# EAGLE design flight_logger_r2 (EAGLE 5.11)
PARTNUM: ABMM-12.000MHZ-B2-T

## Sheet 1 of 3
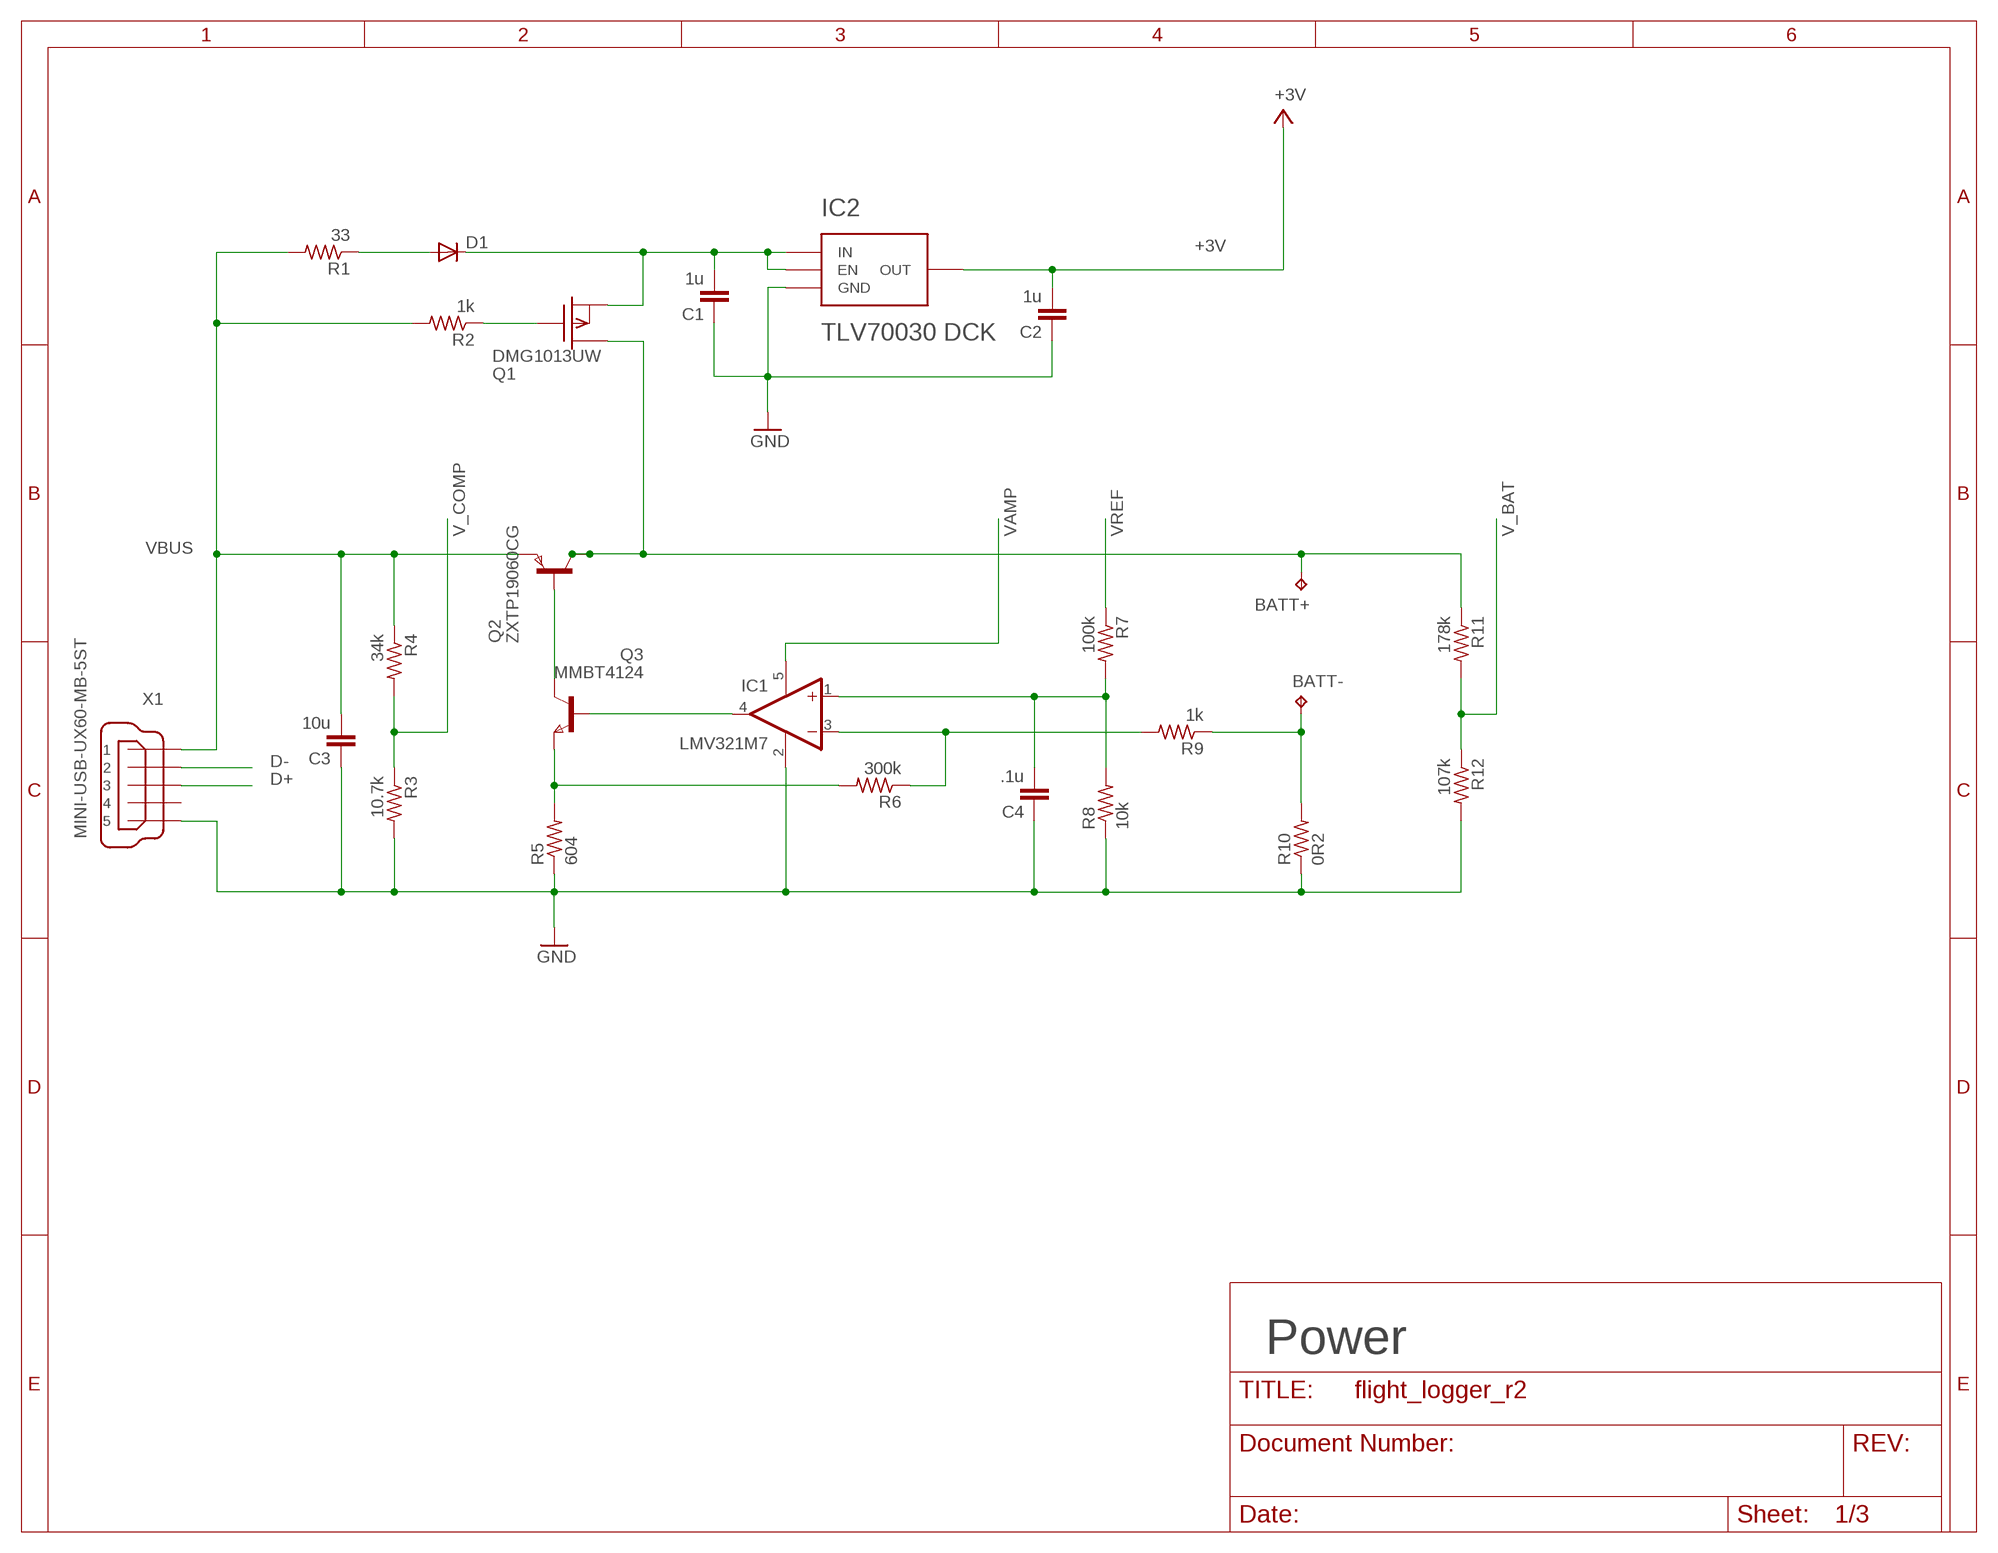
[diagram p0: schematic, sheet 1]

### Parts
BATT+  TPTP18R  [TP18R]
BATT-  TPTP18R  [TP18R]
C1  1u  C-EUC0603  [C0603]
C2  1u  C-EUC0603  [C0603]
C3  10u  C-EUC0805  [C0805]
C4  .1u  C-EUC0603  [C0603]
D1  DIODE-MINIMELF  [MINIMELF]
IC1  LMV321M7  [SC70-5L]
IC2  TLV70030 DCK  TLV700XX_DCK  [SC70-5_DCK]
Q1  DMG1013UW  [SOT323]
Q2  ZXTP19060CG  PNPSOT223  [SOT223]
Q3  MMBT4124  NPNSOT23  [SOT-23]
R1  33  R-US_R0603  [R0603]
R2  1k  R-US_R0603  [R0603]
R3  10.7k  R-US_R0603  [R0603]
R4  34k  R-US_R0603  [R0603]
R5  604  R-US_R0603  [R0603]
R6  300k  R-US_R0603  [R0603]
R7  100k  R-US_R0603  [R0603]
R8  10k  R-US_R0603  [R0603]
R9  1k  R-US_R0603  [R0603]
R10  0R2  R-US_R1206  [R1206]
R11  178k  R-US_R0603  [R0603]
R12  107k  R-US_R0603  [R0603]
X1  MINI-USB-UX60-MB-5ST  [UX60-MB-5ST]

### Nets
+3V: C2.2 IC2.5(OUT) ; also sheet 2,3
D+: X1.3 ; also sheet 3
D-: X1.2 ; also sheet 3
GND: C1.1 C2.1 C3.1 C4.1 IC1.2(V-) IC2.2(GND) R3.2 R5.1 R8.1 R10.1 R12.2 X1.5 ; also sheet 2,3
N$1: Q2.1(B) Q3.1(C)
N$2: Q3.2(E) R5.2 R6.2
N$7: D1.A R1.1
N$8: IC1.4(OUT) Q3.3(B)
N$9: IC1.3(-IN) R6.1 R9.2
N$10: Q1.1(G) R2.1
N$12: C1.2 D1.C IC2.1(IN) IC2.3(EN) Q1.2(S)
N$18: BATT-.TP R9.1 R10.2
N$33: C4.2 IC1.1(+IN) R7.2 R8.2
V_BAT: R11.2 R12.1 ; also sheet 2
V_COMP: R3.1 R4.2 ; also sheet 2
VAMP: IC1.5(V+) ; also sheet 2
VBAT: BATT+.TP Q1.3(D) Q2.2(C) Q2.4(C1) R11.1
VBUS: C3.2 Q2.3(E) R1.2 R2.2 R4.1 X1.1 ; also sheet 3
VREF: R7.1 ; also sheet 2
Unconnected: X1.4

### Notes on the sheet
- Power

## Sheet 2 of 3
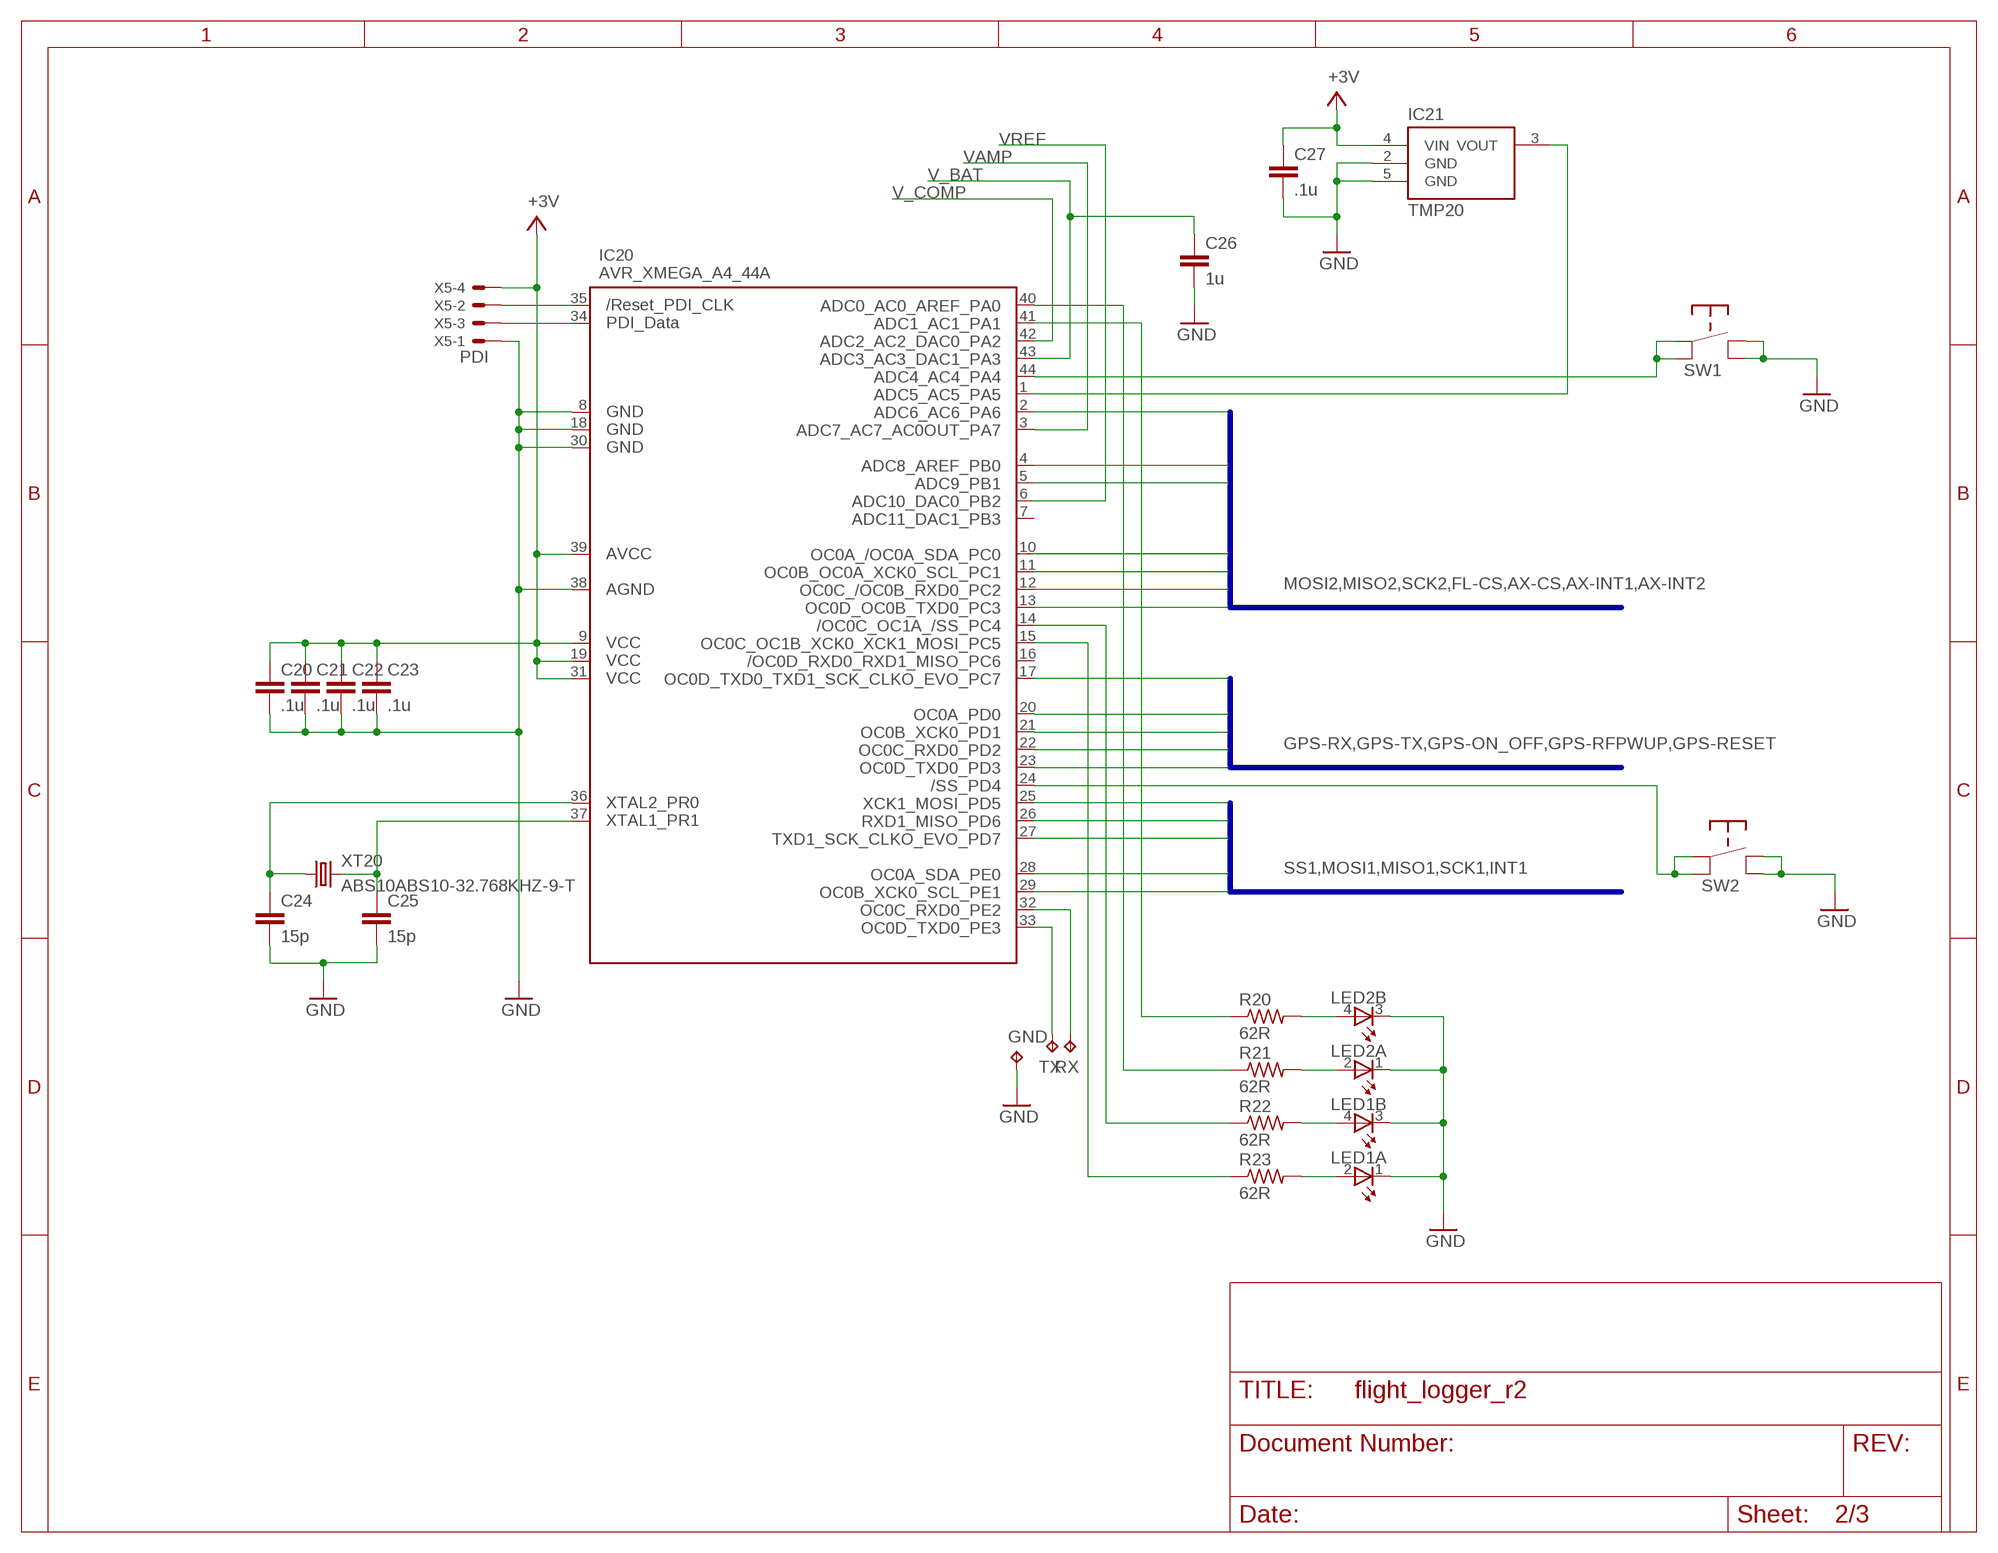
[diagram p1: schematic, sheet 2]

### Parts
C20  .1u  C-EUC0603  [C0603]
C21  .1u  C-EUC0603  [C0603]
C22  .1u  C-EUC0603  [C0603]
C23  .1u  C-EUC0603  [C0603]
C24  15p  C-EUC0603  [C0603]
C25  15p  C-EUC0603  [C0603]
C26  1u  C-EUC0603  [C0603]
C27  .1u  C-EUC0603  [C0603]
GND  TPTP14R  [TP14R]
IC20  AVR_XMEGA_A4_44A  [TQFP44]
IC21  TMP20  TMP20_DCK  [SC70-5_DCK]
LED1  TOPLED-2-LSG_T676_SMALLPAD  [P-LCC-4_SMALLPAD]
LED2  TOPLED-2-LSG_T676_SMALLPAD  [P-LCC-4_SMALLPAD]
R20  62R  R-US_R0603  [R0603]
R21  62R  R-US_R0603  [R0603]
R22  62R  R-US_R0603  [R0603]
R23  62R  R-US_R0603  [R0603]
RX  TPTP14R  [TP14R]
SW1  Power  PANASONIC-EVQP2  [PANASONIC_EVQP2_TACT-SWITCH]
SW2  Mark  PANASONIC-EVQP2  [PANASONIC_EVQP2_TACT-SWITCH]
TX  TPTP14R  [TP14R]
X5  PDI  53047-04  [53047-04]
XT20  ABS10ABS10-32.768KHZ-9-T  ABS10-32.768KHZ-9-T  [ABS10_SMD_CRYSTAL]

### Nets
+3V: C20.1 C21.1 C22.1 C23.1 C27.1 IC20.9(VCC1) IC20.19(VCC2) IC20.31(VCC3) IC20.39(AVCC) IC21.4(VIN) X5.4 ; also sheet 1,3
AX-CS: IC20.4(PB0) ; also sheet 3
AX-INT1: IC20.2(PA6) ; also sheet 3
AX-INT2: IC20.5(PB1) ; also sheet 3
DEBUG-RX: IC20.32(PE2) RX.TP
DEBUG-TX: IC20.33(PE3) TX.TP
FL-CS: IC20.10(PC0) ; also sheet 3
GND: C20.2 C21.2 C22.2 C23.2 C24.2 C25.2 C26.2 C27.2 GND.TP IC20.8(GND1) IC20.18(GND2) IC20.30(GND3) IC20.38(AGND) IC21.2(GND) IC21.5(GND) LED1.1(A:C) LED1.3(B:C) LED2.1(A:C) LED2.3(B:C) SW1.1(NO) SW1.3(NO) SW2.1(NO) SW2.3(NO) X5.1 ; also sheet 1,3
GPS-ON_OFF: IC20.21(PD1) ; also sheet 3
GPS-RESET: IC20.20(PD0) ; also sheet 3
GPS-RFPWUP: IC20.17(PC7) ; also sheet 3
GPS-RX: IC20.23(PD3) ; also sheet 3
GPS-TX: IC20.22(PD2) ; also sheet 3
INT1: IC20.28(PE0) ; also sheet 3
MISO1: IC20.26(PD6) ; also sheet 3
MISO2: IC20.12(PC2) ; also sheet 3
MOSI1: IC20.27(PD7) ; also sheet 3
MOSI2: IC20.13(PC3) ; also sheet 3
N$4: IC20.1(PA5) IC21.3(VOUT)
N$14: C24.1 IC20.36(PR0) XT20.P$1
N$15: C25.1 IC20.37(PR1) XT20.P$2
N$21: IC20.15(PC5) R23.1
N$22: LED2.4(B:A) R20.2
N$23: LED2.2(A:A) R21.2
N$24: IC20.14(PC4) R22.1
N$25: IC20.40(PA0) R21.1
N$26: LED1.4(B:A) R22.2
N$27: LED1.2(A:A) R23.2
N$28: IC20.35(RESET) X5.2
N$29: IC20.34(PDI_DATA) X5.3
N$30: IC20.44(PA4) SW1.2(COMMON) SW1.4(COMMON)
N$31: IC20.41(PA1) R20.1
N$32: IC20.24(PD4) SW2.2(COMMON) SW2.4(COMMON)
SCK1: IC20.25(PD5) ; also sheet 3
SCK2: IC20.11(PC1) ; also sheet 3
SS1: IC20.29(PE1) ; also sheet 3
V_BAT: C26.1 IC20.43(PA3) ; also sheet 1
V_COMP: IC20.42(PA2) ; also sheet 1
VAMP: IC20.3(PA7) ; also sheet 1
VREF: IC20.6(PB2) ; also sheet 1
Unconnected: IC20.7(PB3) IC20.16(PC6)

### Buses
SS1,MOSI1,MISO1,SCK1,INT1
GPS-RX,GPS-TX,GPS-ON_OFF,GPS-RFPWUP,GPS-RESET
MOSI2,MISO2,SCK2,FL-CS,AX-CS,AX-INT1,AX-INT2

## Sheet 3 of 3
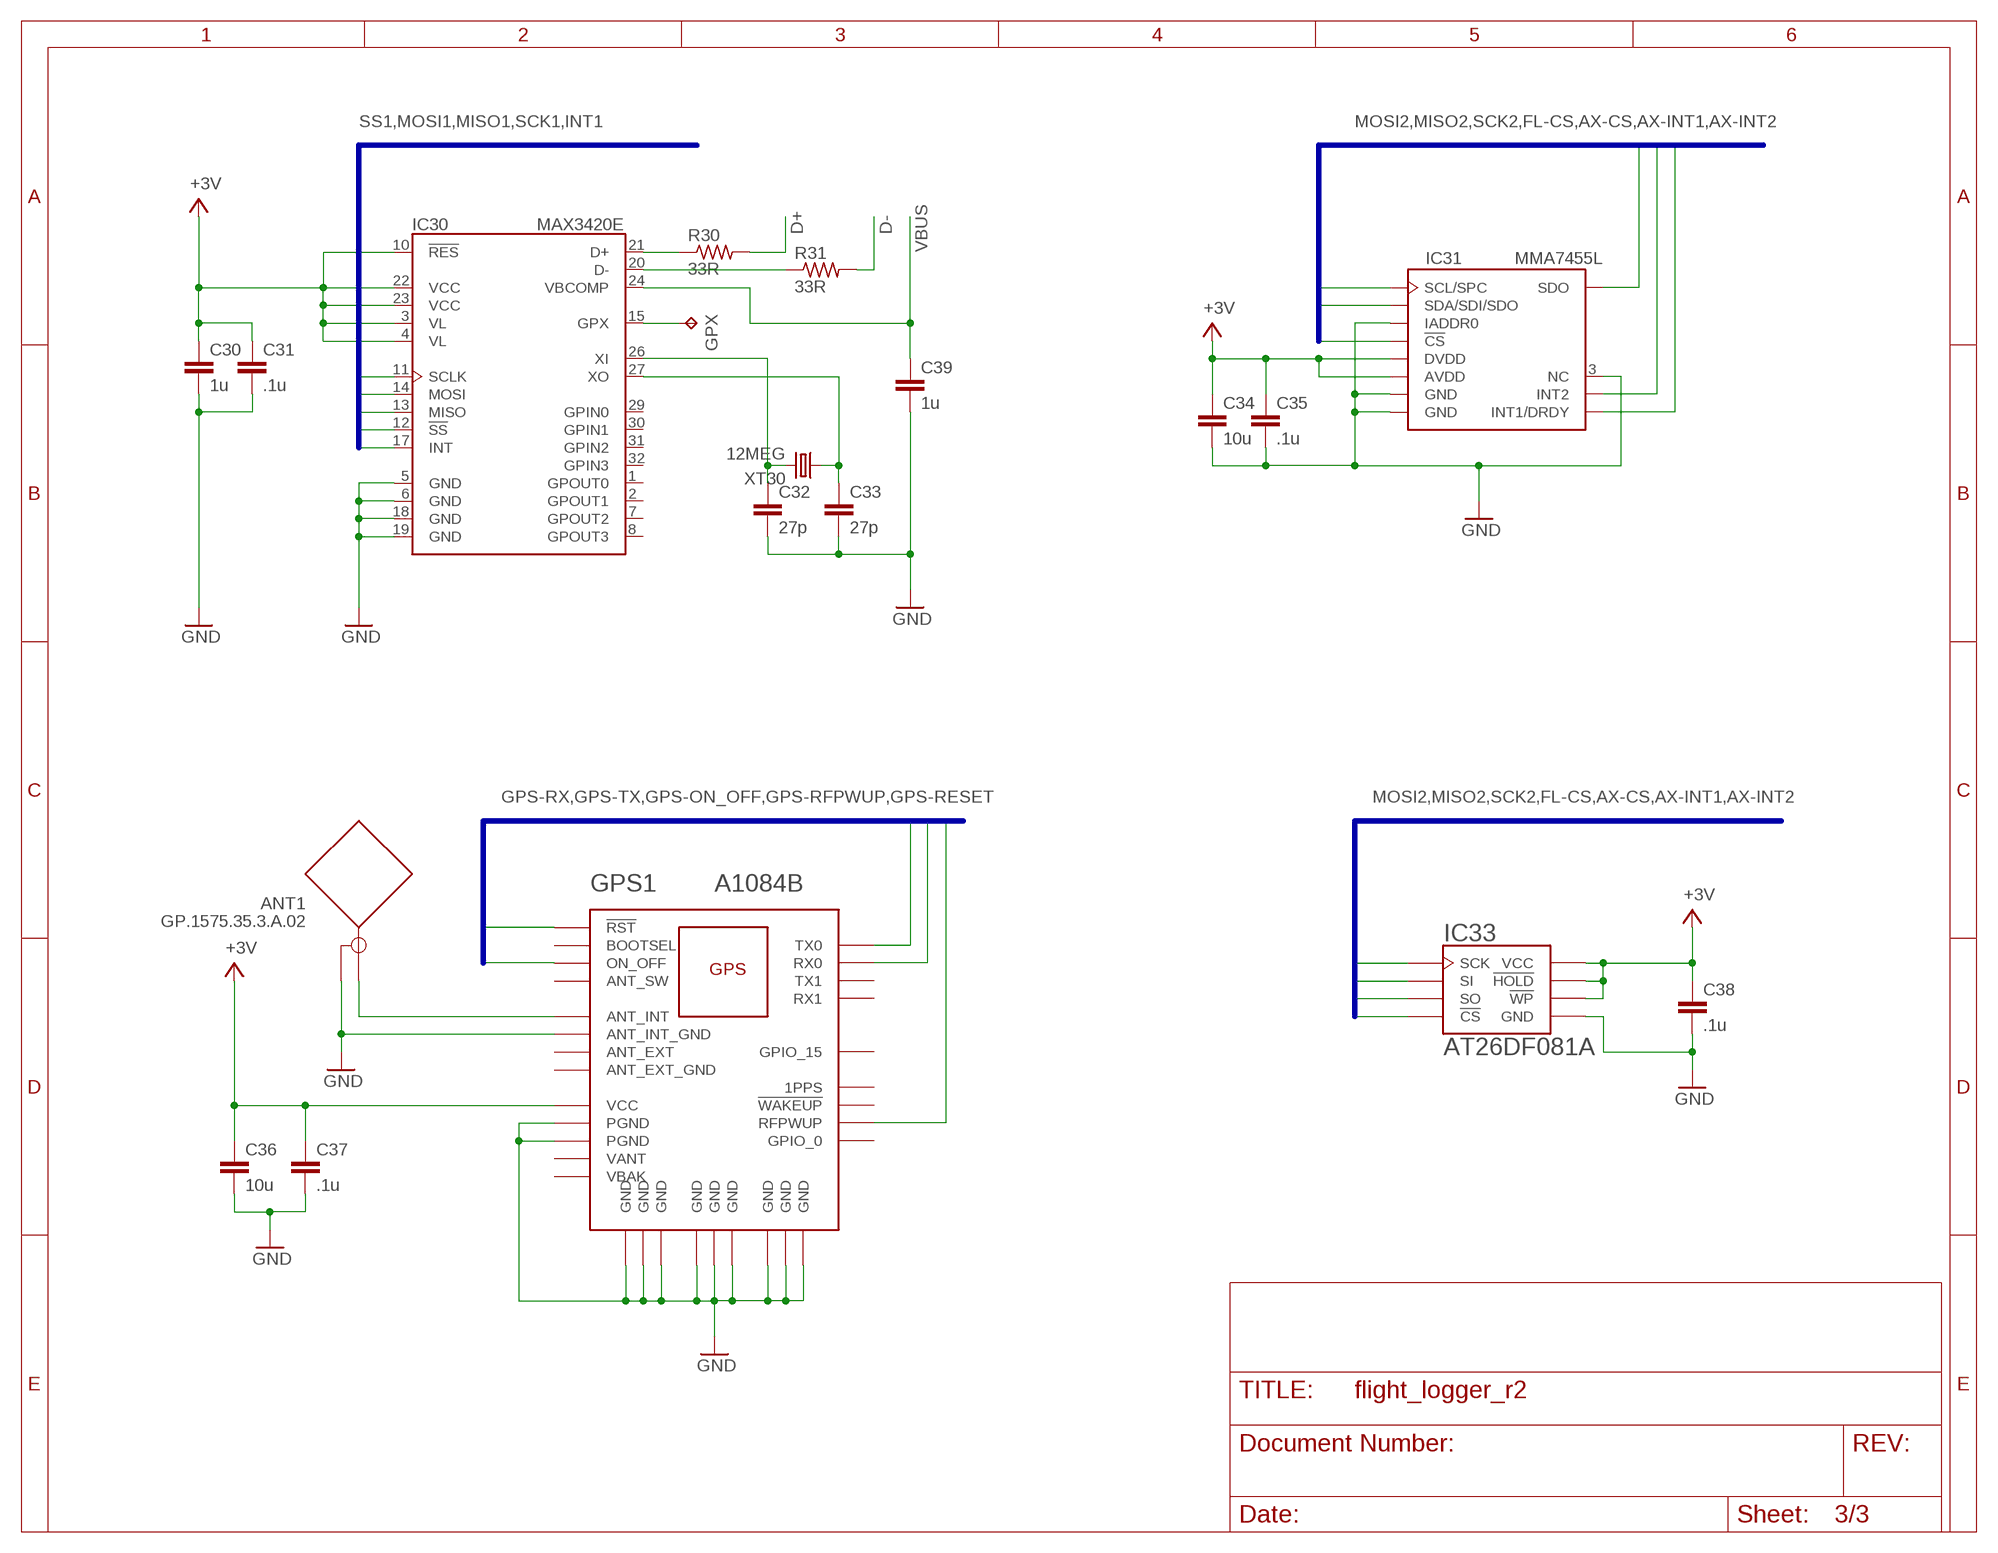
[diagram p2: schematic, sheet 3]

### Parts
ANT1  GP.1575.35.3.A.02  TAOGLAS_GP-1575.35  [TAOGLAS_GP35-A_GPS_PATCH_ANTENNA]
C30  1u  C-EUC0603  [C0603]
C31  .1u  C-EUC0603  [C0603]
C32  27p  C-EUC0603  [C0603]
C33  27p  C-EUC0603  [C0603]
C34  10u  C-EUC0603  [C0603]
C35  .1u  C-EUC0603  [C0603]
C36  10u  C-EUC0805  [C0805]
C37  .1u  C-EUC0603  [C0603]
C38  .1u  C-EUC0603  [C0603]
C39  1u  C-EUC0603  [C0603]
GPS1  A1084B  VINCOTECH-GPS_A1084  [A1084_GPS]
GPX  TPTP10R  [TP10R]
IC30  MAX3420E  MAX3420EECJ  [LQFP-32]
IC31  MMA7455L  MMA7455LLARGEPAD  [LGA-14-LARGEPAD]
IC33  AT26DF081A  AT26DF081A-SU  [EIAJ-SOIC8]
R30  33R  R-US_R0603  [R0603]
R31  33R  R-US_R0603  [R0603]
XT30  12MEG  ABMM-XTAL  [XTAL-5.2X7.2]

### Nets
+3V: C30.1 C31.1 C34.1 C35.1 C36.1 C37.1 C38.1 GPS1.P$3(VCC) IC30.3(VL) IC30.4(VL) IC30.10(!RES) IC30.22(VCC) IC30.23(VCC) IC31.1(DVDD) IC31.6(AVDD) IC33.3(!WP) IC33.7(!HOLD) IC33.8(VCC) ; also sheet 1,2
AX-CS: IC31.7(!CS) ; also sheet 2
AX-INT1: IC31.8(INT1/DRDY) ; also sheet 2
AX-INT2: IC31.9(INT2) ; also sheet 2
D+: R30.2 ; also sheet 1
D-: R31.2 ; also sheet 1
FL-CS: IC33.1(!CS) ; also sheet 2
GND: ANT1.GND C30.2 C31.2 C32.2 C33.2 C34.2 C35.2 C36.2 C37.2 C38.2 C39.2 GPS1.GND@1(GND) GPS1.GND@2(GND) GPS1.GND@3(GND) GPS1.GND@4(GND) GPS1.GND@5(GND) GPS1.GND@6(GND) GPS1.GND@7(GND) GPS1.GND@8(GND) GPS1.GND@9(GND) GPS1.P$6(PGND) GPS1.P$7(PGND) GPS1.P$13(ANT_INT_GND) IC30.5(GND) IC30.6(GND) IC30.18(GND) IC30.19(GND) IC31.2(GND) IC31.3(NC) IC31.4(IADDR0) IC31.5(GND) IC33.4(GND) ; also sheet 1,2
GPS-ON_OFF: GPS1.P$19(ON_OFF) ; also sheet 2
GPS-RESET: GPS1.P$1(!RST) ; also sheet 2
GPS-RFPWUP: GPS1.P$4(RFPWUP) ; also sheet 2
GPS-RX: GPS1.P$22(RX0) ; also sheet 2
GPS-TX: GPS1.P$21(TX0) ; also sheet 2
INT1: IC30.17(INT) ; also sheet 2
MISO1: IC30.13(MISO) ; also sheet 2
MISO2: IC31.12(SDO) IC33.2(SO) ; also sheet 2
MOSI1: IC30.14(MOSI) ; also sheet 2
MOSI2: IC31.13(SDA/SDI/SDO) IC33.5(SI) ; also sheet 2
N$3: GPX.TP IC30.15(GPX)
N$6: ANT1.ANT GPS1.P$12(ANT_INT)
N$16: C33.1 IC30.27(XO) XT30.1
N$17: C32.1 IC30.26(XI) XT30.3
N$19: IC30.21(D+) R30.1
N$20: IC30.20(D-) R31.1
SCK1: IC30.11(SCLK) ; also sheet 2
SCK2: IC31.14(SCL/SPC) IC33.6(SCK) ; also sheet 2
SS1: IC30.12(!SS) ; also sheet 2
VBUS: C39.1 IC30.24(VBCOMP) ; also sheet 1
Unconnected: GPS1.P$2(BOOTSEL) GPS1.P$5(GPIO_15) GPS1.P$8(VANT) GPS1.P$9(ANT_EXT) GPS1.P$10(ANT_EXT_GND) GPS1.P$11(ANT_SW) GPS1.P$14(GPIO_0) GPS1.P$15(VBAK) GPS1.P$16(1PPS) GPS1.P$17(!WAKEUP) GPS1.P$18(RX1) GPS1.P$20(TX1) IC30.1(GPOUT0) IC30.2(GPOUT1) IC30.7(GPOUT2) IC30.8(GPOUT3) IC30.29(GPIN0) IC30.30(GPIN1) IC30.31(GPIN2) IC30.32(GPIN3)

### Buses
SS1,MOSI1,MISO1,SCK1,INT1
GPS-RX,GPS-TX,GPS-ON_OFF,GPS-RFPWUP,GPS-RESET
MOSI2,MISO2,SCK2,FL-CS,AX-CS,AX-INT1,AX-INT2

## Library data of the parts
ANT1 = m_misc:TAOGLAS_GP-1575.35: 35mm*35mm GPS Patch Antenna, 1575MHz Part No.: GP.1575.35.3.A.02 GP.35A 3.5mm thick GPS Patch Antenna, 1575MHz (DA1574Q) 35mm*35mm*3.5mm ROHS Compliant; MANUF: Taoglas:GP.1575.35.3.A.02;; PARTNUM: GP.1575.35.3.A.02
BATT+ BATT- GND GPX RX TX = testpad:TP: Test pad
C1-C4 C20-C27 C30-C39 = rcl:C-EU: CAPACITOR, European symbol
D1 = diode:DIODE-: DIODE
GPS1 = m_module:VINCOTECH-GPS_A1084: Vincotech A1084 GPS Receiver Vincotech?s GPS modules A1084-A and A1084-B are highly integrated GPS receiver modules that can be used as SMT components. They are capable of receiving signals from up to 20 GPS satellites and transferring them into position and timing information that can be read over a serial port. This new generation of GPS modules combines small size and high-end GPS functionality at low power consumption: Operable at 3.3V / 26mA (typ.) @ 1fix per second UART interface at CMOS level Small form factor of 15.24 x 15.24 mm2 (0.6? x 0.6?) Supported temperature range: -40°C to +85°C Single-sided SMT component, for reflow soldering RoHS compliant, lead-free Tape & reel packaging Excellent antenna support The A1084 receivers are available as off-the-shelf components, 100% tested and shipped in standard tape-and-reel package.
IC1 = linear:LMV321?*: General Purpose, Low Voltage, Rail-to-Rail Output Operational Amplifiers Source: http://www.national.com/mpf/LM/LMV321.html http://www.national.com/dt/lmv_qual.pdf
IC2 = m_vreg:TLV700XX: Texas Instruments 200-mA, Low-IQ, Low-Dropout Regulator for Portable Devices The TLV700xx series of low-dropout (LDO) linear regulators are low quiescent current devices with excellent line and load transient performance. These LDOs are designed for power-sensitive applications. A precision bandgap and error amplifier provides overall 2% accuracy. Low output noise, very high power-supply rejection ratio (PSRR), and low dropout voltage make this series of devices ideal for most battery-operated handheld equipment. All device versions have thermal shutdown and current limit for safety. Furthermore, these devices are stable with an effective output capacitance of only 0.1 ?F. This feature enables the use of cost-effective capacitors that have higher bias voltages and temperature derating. The devices regulate to specified accuracy with no output load. The TLV700xx series of LDOs are available in 1,5-mm x 1,5-mm SON-6, SOT23-5, and SC-70 packages. FEATURES Very Low Dropout: 175 mV at 200 mA 2% Accuracy Low IQ: 31 ?A Available in Fixed-Output Voltages from 0.7 V to 4.8 V High PSRR: 68 dB at 1 kHz Stable with Effective Capacitance of 0.1 ?F Thermal Shutdown and Overcurrent Protection Available in 1,5-mm × 1,5-mm SON-6, SOT23-5, and SC-70 packages
IC20 = xmega:AVR_XMEGA_A4_: Device for Atmel AVR XMEGA A4 Series
IC21 = m_ic-signal:TMP20: ±2.5°C Low-Power, AnalogOut TEMPERATURE SENSOR FEATURES ±2.5°C ACCURACY FROM –55°C to +130°C SUPPLY VOLTAGE RANGE: 1.8V to 5.5V LOW POWER: 4μA (max) MicroSIZE PACKAGES: SOT563, SC70-5 SC70 PIN-COMPATIBLE WITH LM20 DESCRIPTION The TMP20 is a CMOS, precision analog output temperature sensor available in the tiny SOT563 package. The TMP20 operates from –55°C to +130°C on a supply voltage of 2.7V to 5.5V with a supply current of 4μA. Operation as low as 1.8V is possible for temperatures between +15°C and +130°C. The linear transfer function has a slope of –11.77mV/°C (typ) and has an output voltage of 1.8639V (typ) at 0°C. The TMP20 has a ±2.5°C accuracy across the entire specified temperature range of –55°C to +130°C. The TMP20 4μA (max) supply current limits self-heating of the device to less than 0.01°C. When V+ is less than 0.5V, the device is in shutdown mode and consumes less than 20nA (typ). The TMP20 is available in either a 5-lead SC70 or 6-lead SOT563 package, reducing the overall board space required.; PARTNUM: TMP20AIDCK
IC30 = m_ic-comm:MAX3420E: USB Peripheral Controller with SPI Interface General Description The MAX3420E contains the digital logic and analog circuitry necessary to implement a full-speed USB peripheral compliant to USB specification rev 2.0. A built-in full-speed transceiver features ±15kV ESD pro- tection and programmable USB connect and discon- nect. An internal serial-interface engine (SIE) handles low-level USB protocol details such as error checking and bus retries. The MAX3420E operates using a regis- ter set accessed by an SPITM interface that operates up to 26MHz. Any SPI master (microprocessor, ASIC, DSP, etc.) can add USB functionality using the simple 3- or 4-wire SPI interface. Internal level translators allow the SPI interface to run at a system voltage between 1.71V and 3.6V. USB timed operations are done inside the MAX3420E with inter- rupts provided at completion so an SPI master does not need timers to meet USB timing requirements. The MAX3420E includes four general-purpose inputs and outputs so any microprocessor that uses I/O pins to implement the SPI interface can reclaim the I/O pins and gain additional ones. The MAX3420E operates over the extended -40°C to +85°C temperature range and is available in a 32-pin LQFP package (7mm x 7mm) and a space-saving 24- pin TQFN package (4mm x 4mm). Microprocessor-Independent USB Solution Complies with USB Specification Revision 2.0 (Full-Speed Operation) Integrated Full-Speed USB Transceiver Firmware/Hardware Control of an Internal D+ Pullup Resistor Programmable 3- or 4-Wire 26MHz SPI Interface Level Translators and VL Input Allow Independent System Interface Voltage Internal Comparator Detects VBUS for Self-Powered Applications ESD Protection on D+, D-, and VBCOMP Interrupt Output Pin (Level or Programmable Edge) Allows Polled or Interrupt-Driven SPI Interface Intelligent USB Serial-Interface Engine (SIE) Automatically Handles USB Flow Control and Double Buffering Handles Low-Level USB Signaling Details Contains Timers for USB Time-Sensitive Operations So SPI Master Does Not Need to Time Events Built-In Endpoint FIFOs EP0: CONTROL (64 Bytes) EP1: OUT, Bulk or Interrupt, 2 x 64 Bytes (Double-Buffered) EP2: IN, Bulk or Interrupt, 2 x 64 Bytes (Double-Buffered) EP3: IN, Bulk or Interrupt (64 Bytes) Double-Buffered Data Endpoints Increase Throughput by Allowing the SPI Master to Transfer Data Concurrently with USB Transfers Over the Same Endpoint SETUP Data Has Its Own 8-Byte FIFO, Simplifying Firmware Four General-Purpose Inputs and Four General- Purpose Outputs Space-Saving LQFP and TQFN Packages; PARTNUM: MAX3420EECJ
IC31 = m_ic-signal:MMA7455L: Freescale Semiconductor ±2g/±4g/±8g Three Axis Low-g Digital Output Accelerometer The MMA7455L is a Digital Output (I2C/SPI), low power, low profile capacitive micromachined accelerometer featuring signal conditioning, a low pass filter, temperature compensation, self-test, configurable to detect 0g through interrupt pins (INT1 or INT2), and pulse detect for quick motion detection. 0g offset and sensitivity are factory set and require no external devices. The 0g offset can be customer calibrated using assigned 0g registers and g-Select which allows for command selection for 3 acceleration ranges (2g/4g/8g). The MMA7455L includes a Standby Mode that makes it ideal for handheld battery powered electronics. Features Digital Output (I2C/SPI) 3mm x 5mm x 1mm LGA-14 Package Self-Test for Z-Axis Low Voltage Operation: 2.4 V ? 3.6 V User Assigned Registers for Offset Calibration Programmable Threshold Interrupt Output Level Detection for Motion Recognition (Shock, Vibration, Freefall) Pulse Detection for Single or Double Pulse Recognition Sensitivity (64 LSB/g @ 2g and @ 8g in 10-Bit Mode) Selectable Sensitivity (±2g, ±4g, ±8g) for 8-bit Mode Robust Design, High Shocks Survivability (5,000g) RoHS Compliant Environmentally Preferred Product Low Cost; PARTNUM: MMA7455L
IC33 = m_ic-other:AT26DF081A: Atmel 8-megabit 2.7-volt Minimum SPI Serial Flash Memory The AT26DF081A is a serial interface Flash memory device designed for use in a wide variety of high-volume consumer-based applications in which program code is shadowed from Flash memory into embedded or external RAM for execution. The flexible erase architecture of the AT26DF081A, with its erase granularity as small as 4 Kbytes, makes it ideal for data storage as well, eliminating the need for additional data storage EEPROM devices. The physical sectoring and the erase block sizes of the AT26DF081A have been optimized to meet the needs of today's code and data storage applications. By optimizing the size of the physical sectors and erase blocks, the memory space can be used much more efficiently. Because certain code modules and data storage segments must reside by themselves in their own protected sectors, the wasted and unused memory space that occurs with large sectored and large block erase Flash memory devices can be greatly reduced. This increased memory space efficiency allows additional code routines and data storage segments to be added while still maintaining the same overall device density. Single 2.7V - 3.6V Supply Serial Peripheral Interface (SPI) Compatible Supports SPI Modes 0 and 3 70 MHz Maximum Clock Frequency Flexible, Uniform Erase Architecture 4-Kbyte Blocks 32-Kbyte Blocks 64-Kbyte Blocks Full Chip Erase Individual Sector Protection with Global Protect/Unprotect Feature One 32-Kbyte Top Boot Sector Two 8-Kbyte Sectors One 16-Kbyte Sector Fifteen 64-Kbyte Sectors Hardware Controlled Locking of Protected Sectors Flexible Programming Options Byte/Page Program (1 to 256 Bytes) Sequential Program Mode Capability Automatic Checking and Reporting of Erase/Program Failures JEDEC Standard Manufacturer and Device ID Read Methodology Low Power Dissipation 5 mA Active Read Current (Typical) 25 ?A Deep Power-down Current (Typical) Endurance: 100,000 Program/Erase Cycles Data Retention: 20 Years Complies with Full Industrial Temperature Range Industry Standard Green (Pb/Halide-free/RoHS Compliant) Package Options 8-lead SOIC (150-mil and 200-mil wide)
LED1 LED2 = m_opto:TOPLED-2-: Multi TOPLED® (two color) LG T672, LP T672 LSY T67B LSW T67C LSY T675 LSY T676 LSG T677 LSG T770 Source: http://www.osram.convergy.de/; PARTNUM: LSG T676-
Q1 = m_transistor:DMG1013UW: DMG1013UW P-CHANNEL ENHANCEMENT MODE MOSFET Features Low On-Resistance Low Gate Threshold Voltage Low Input Capacitance Fast Switching Speed Low Input/Output Leakage Lead Free By Design/RoHS Compliant (Note 1) ESD Protected Up To 3KV "Green" Device (Note 2) Qualified to AEC-Q101 Standards for High Reliability; MANUF: diodes:DMG1013UW;; PARTNUM: DMG1013UW
Q2 = zetex:PNPSOT223: PNP TRANSISTOR
Q3 = zetex:NPNSOT23: NPN TRANSISTOR
R1-R12 R20-R23 R30 R31 = rcl:R-US_: RESISTOR, American symbol
SW1 SW2 = m_switch-mechanical:PANASONIC-EVQP2: 4.7mm x 3.5 mm SMD Light Touch Switches; PARTNUM: EVQP2xxxx
X1 = con-hirose:MINI-USB-: MINI USB Connector Source: http://www.hirose.co.jp/cataloge_hp/e24000019.pdf
X5 = con-molex:53?-04: CONNECTOR wire to board 1.25 mm (.049 inch) pitch header
XT20 = m_misc:ABS10: 32.768kHz SMD LOW PROFILE CRYSTAL FEATURES: Low frequency in small size SMD 1.0mm height ideal for high density circuit boards Ceramic package offers excellent environmental & heat resistance Extended temperature -40°C to +85°C for industrial applications PARAMETERS ABRACON P/N ABS10 Nominal Frequency 32.768 kHz Operating Temperature -40°C to + 85°C Turn-over Temperature +25°C to ±5°C Storage Temperature -55°C to +125°C Frequency Tolerance ±20 ppm max. (see option) Temperature Coefficient (beta) - 0.034±0.006 ppm/T2 Equivalent Series Resistance 70 kohms max. Load Capacitance CL 12.5 pF (see option) Drive Level 1.0 ?W max. Aging (first year) 25°C ± 5 ppm max. Insulation Resistance 500 M? with 100 Vdc ±15V Shunt capacitance Co 1.0pF typ. Motional capacitance C1 2.0fF typ.; PARTNUM: ABS10-32.768KHZ-9-T
XT30 = m_misc:ABMM-XTAL: Surface Mount Crystal PARAMETERS ABRACON P/N ABMM Frequency Range 6.0 MHz to 125 MHz Operation Mode AT-cut 6.0 MHz ~ 33.0 MHz (Fundamental: Standard) 33.01 MHz - 125 MHz (Third-Overtone: Standard) 33.01 MHz ~ 50.0 MHz (Fundamental: See options) Operating Temperature - 10°C to + 60°C (see options) Storage Temperature - 40°C to + 85°C Frequency Tolerance at +25°C ± 50 ppm max. (see options) Frequency Stability over the Operating Temp. (Ref to +25°C) ± 50 ppm max. (see options) Equivalent Series Resistance See Table 1 Shunt Capacitance C0 7pF max. Load Capacitance CL 18pF (see options) Drive Level 500?W max., 100?W typical Aging at 25°C Per Year ± 5ppm max. Insulation Resistance 500? min at 100Vdc ± 15V Frequency (MHz) ESR (?) Frequency (MHz) ESR (?) 6.000 - 11.999(Fund) 70 20.000 - 50.000(Fund) 40 12.000 - 20.000(Fund) 50 33.000 - 125.00(3rd O/T) 80; PARTNUM: ABMM-Freq-_-R___-_-_-_-_-_

## Board
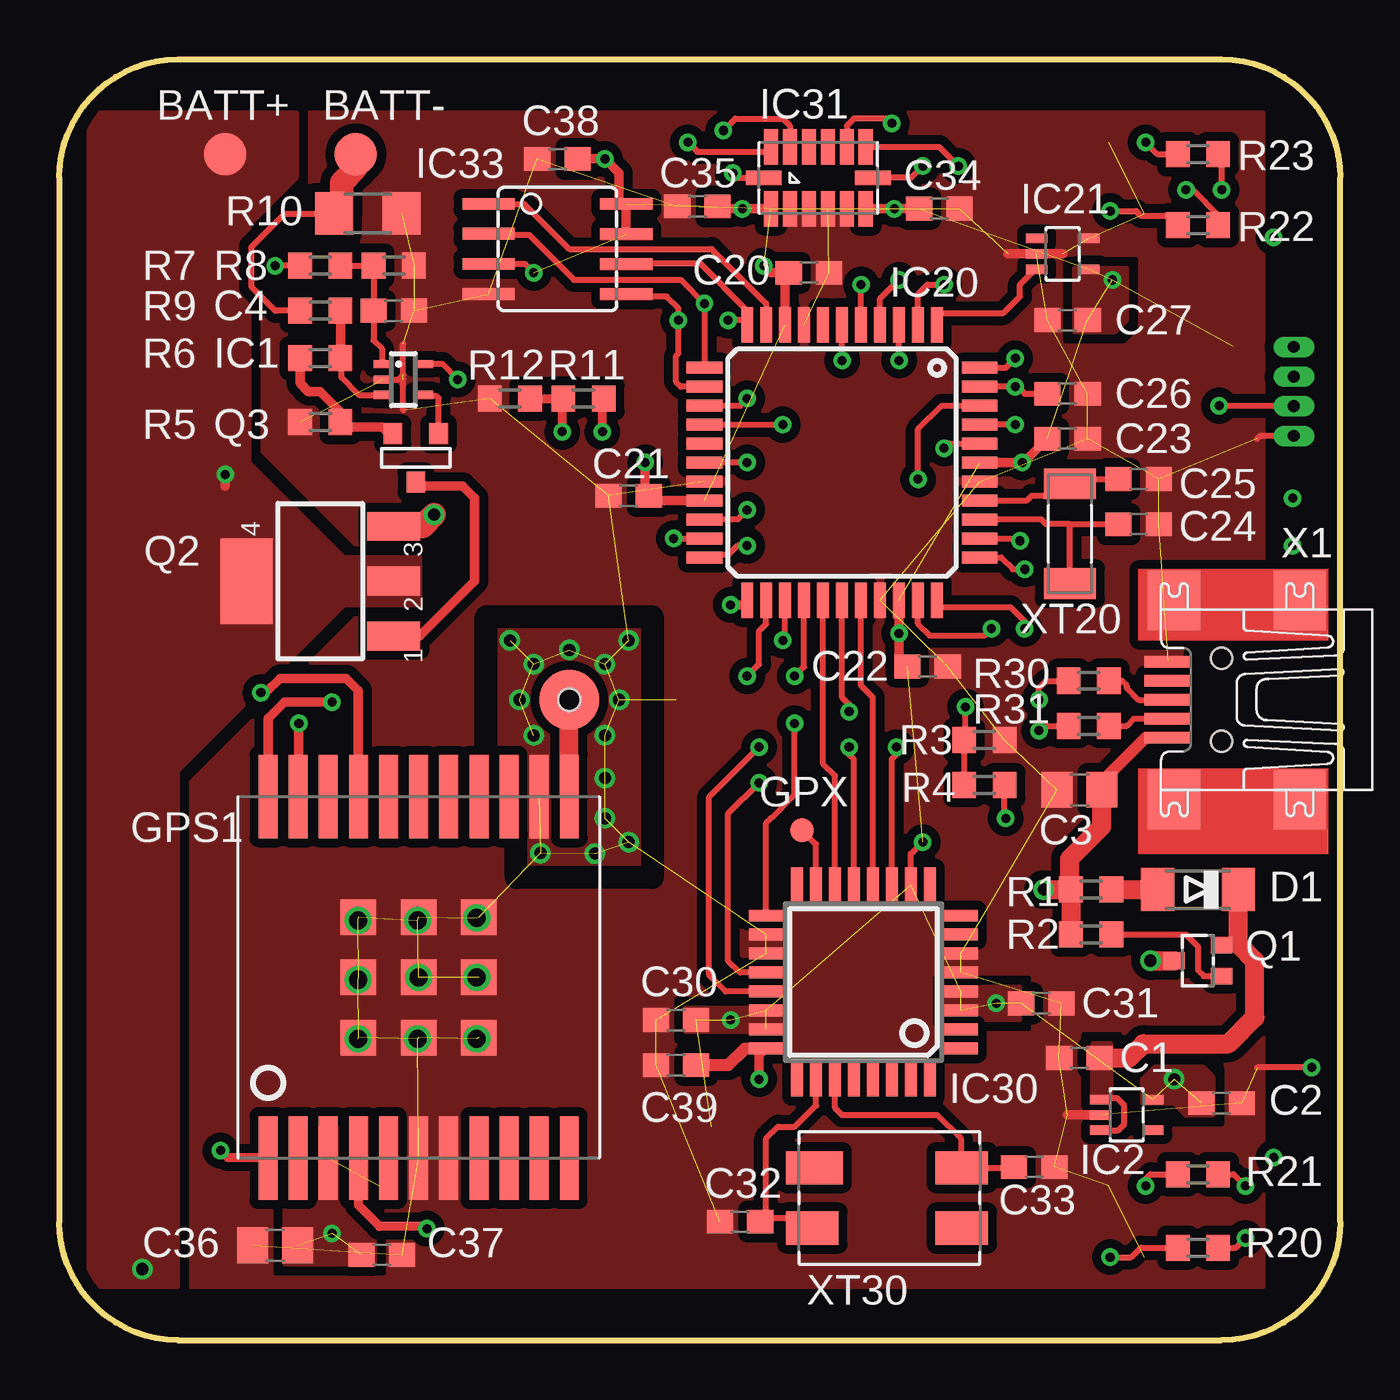
[diagram p3: board, top side]
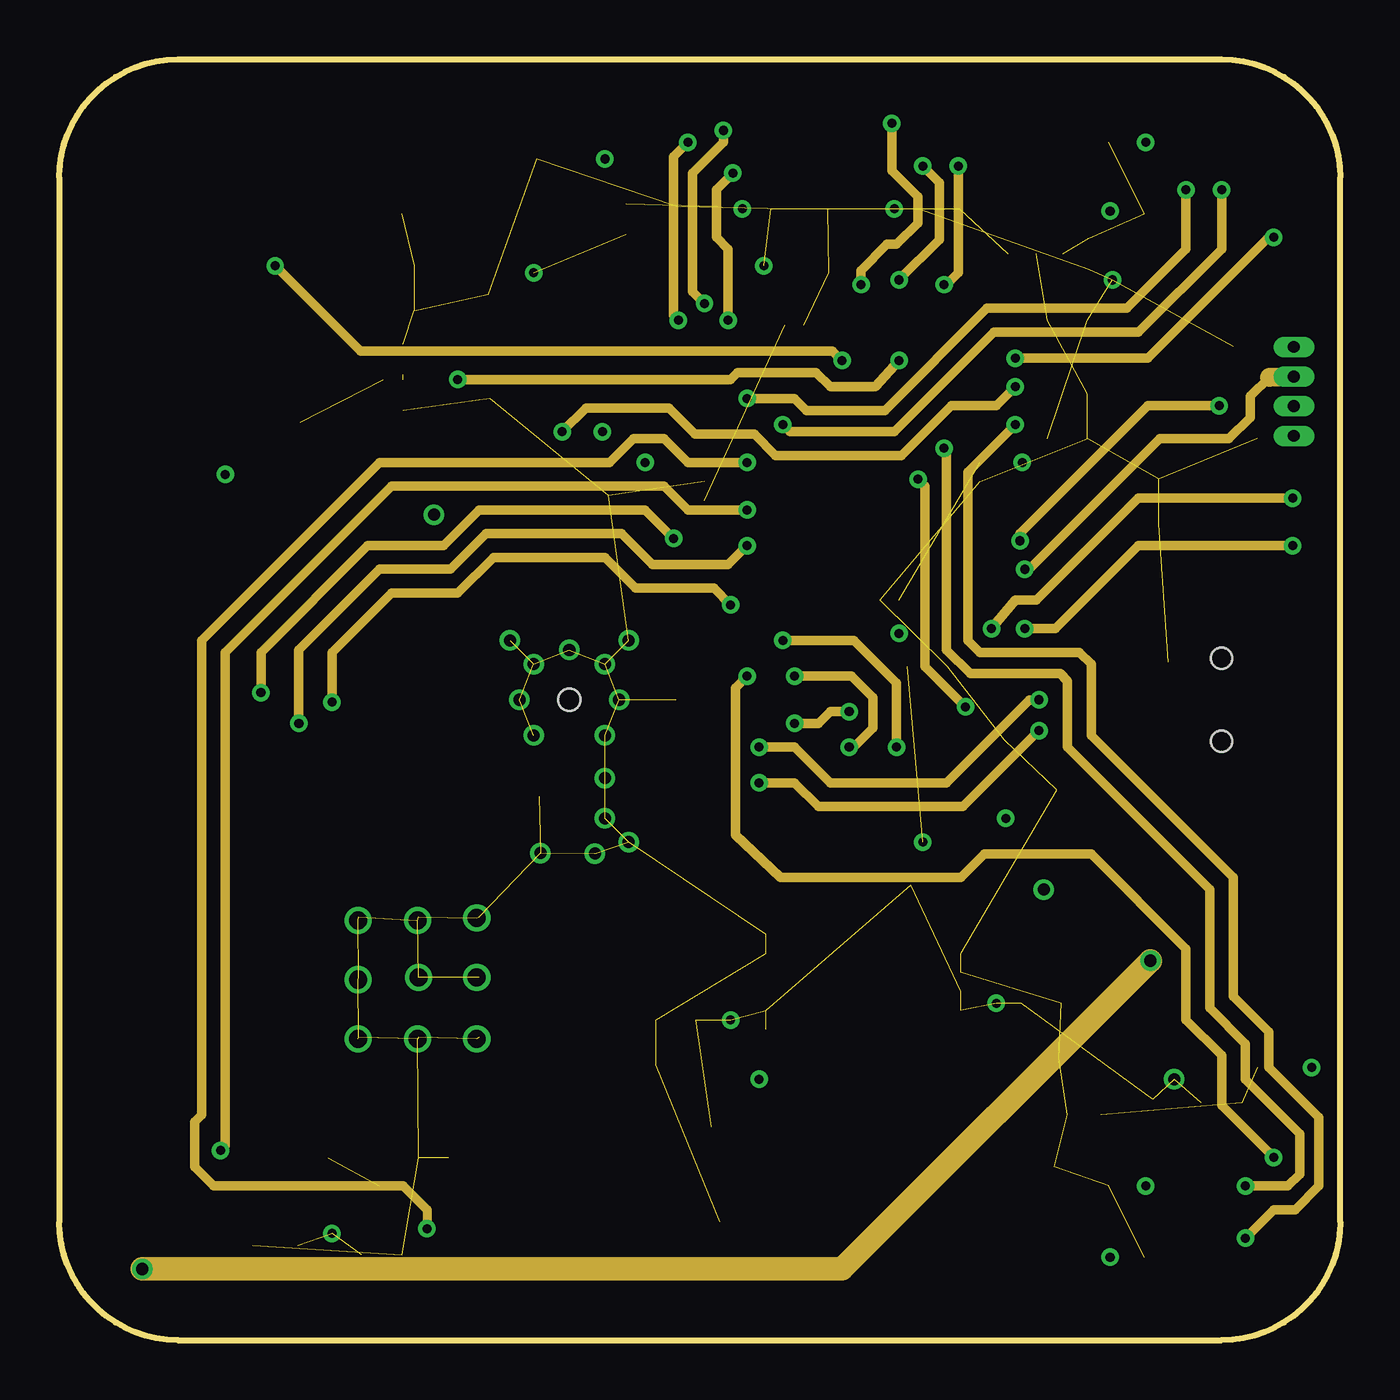
[diagram p4: board, inner layer Route2]
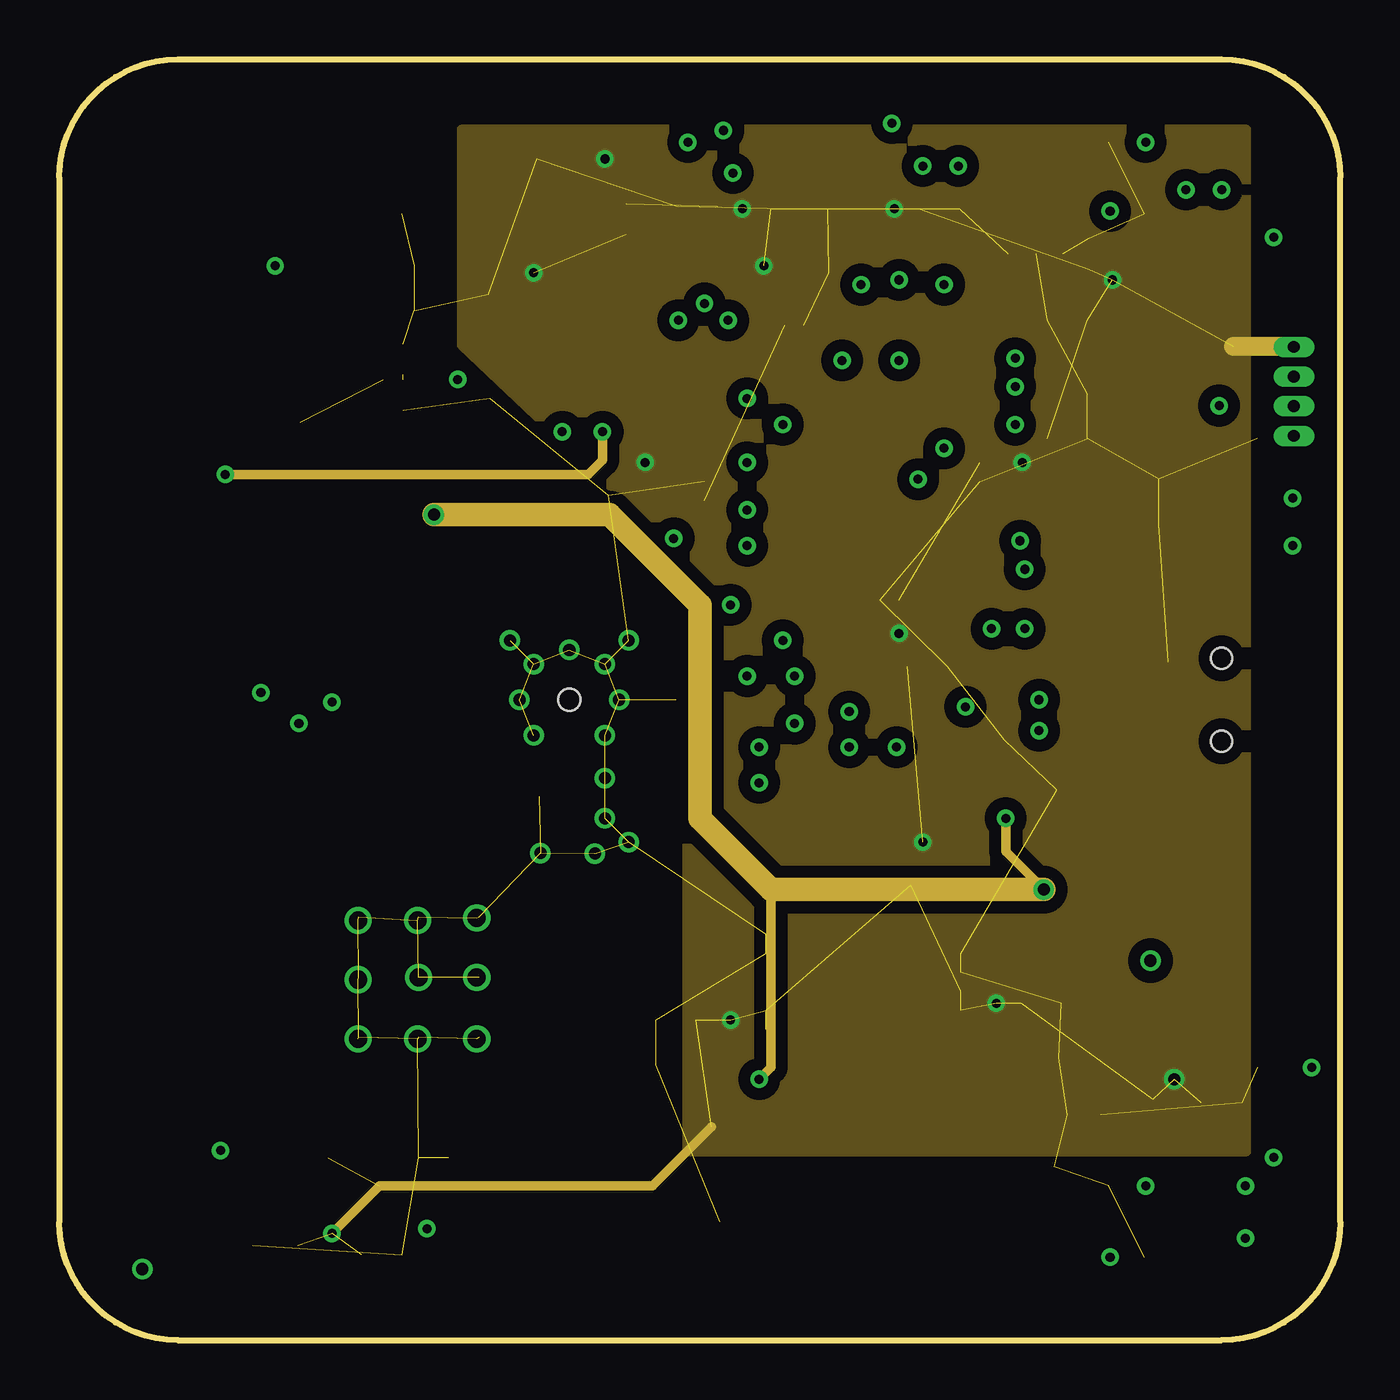
[diagram p5: board, inner layer Route15]
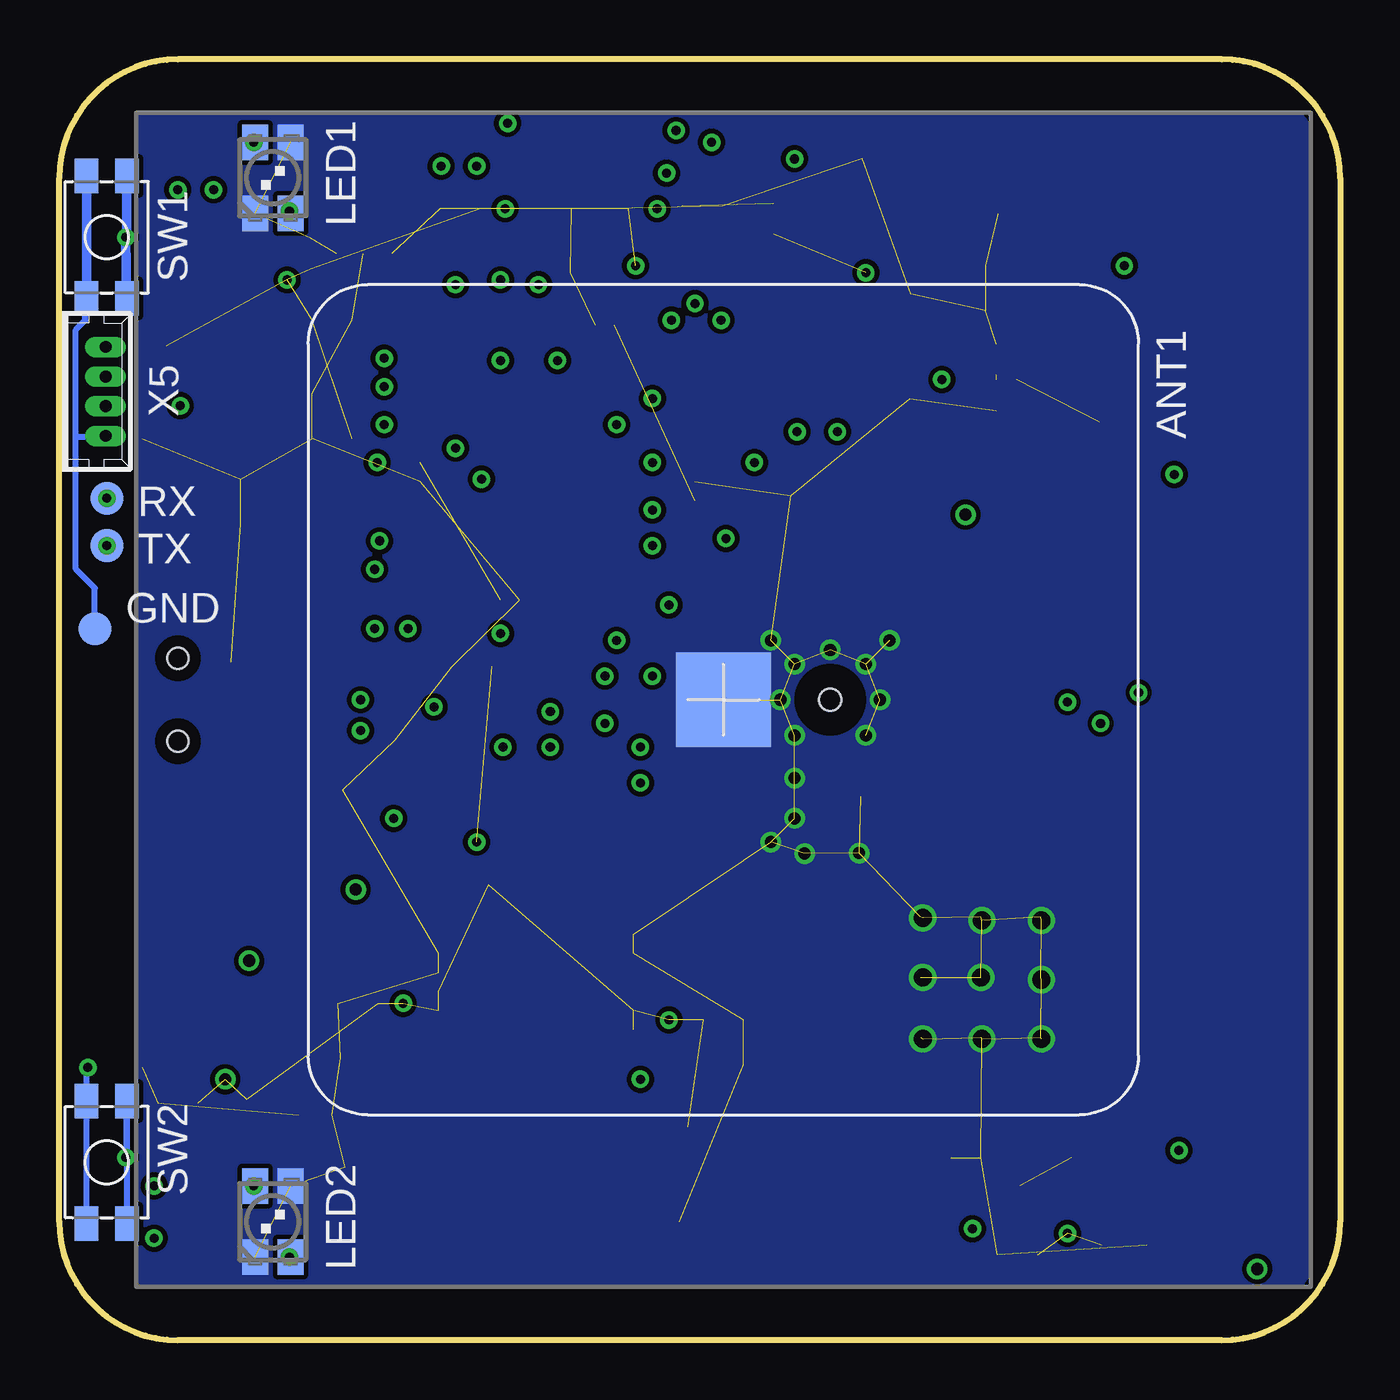
[diagram p6: board, bottom side, seen from below]

Size 54 x 54 mm. Coordinates in mm from the lower left corner, seen from the top.
Outline: 0,49 arc-90 5,54 49,54 arc-90 54,49 54,5 arc-90 49,0 5,0 arc-90 0,5 0,49
Copper layers (1+2*15+16): Top 0.035mm / dielectric 0.52mm / Route2 0.035mm / dielectric 0.52mm / Route15 0.035mm / dielectric 0.52mm / Bottom 0.035mm
Design rules "advanced-circuits-4-layer": minimum track width 7mil, minimum drill 15mil, track to track 7mil, track to pad 7mil, pad to pad 7mil, via to via 7mil, smd to smd 0mil, copper to edge 20mil, drill to drill 15mil, minimum pad ring 7mil, minimum via ring 7mil, stop-mask expansion 2.5mil, vias tented up to drill 20mil, thermal gap 10mil
tRestrict: area 30,48 to 34,50; 6 lines

### Footprints (pad centres in the part's own frame; a part is rotated, then mirrored left to right if it is on the bottom)
TAOGLAS_GP35-A_GPS_PATCH_ANTENNA = smd 2.5 x 2.5 bottom: ANT 0,-4.5 | smd 4 x 4: GND 0,0 | hole 0.95: 0,-4.5
TP18R = smd 1.8 x 1.8: TP 0,0
C0603 = smd 1.1 x 1: 1 -0.85,0; 2 0.85,0
C0805 = smd 1.3 x 1.5: 1 -0.95,0; 2 0.95,0
MINIMELF = smd 1.4 x 1.8: A 1.7,0; C -1.7,0
TP14R = smd 1.4 x 1.4: TP 0,0
A1084_GPS = smd 1.5 x 1.5: GND@1 -2.54,2.54; GND@2 0,2.54; GND@3 2.54,2.54; GND@4 -2.54,0; GND@5 0,0; GND@6 2.54,0; GND@7 -2.54,-2.54; GND@8 0,-2.54; GND@9 2.54,-2.54 | smd 3.524 x 0.8: P$1 -7.62,6.35; P$2 -7.62,5.08; P$3 -7.62,3.81; P$4 -7.62,2.54; P$5 -7.62,1.27; P$6 -7.62,0; P$7 -7.62,-1.27; P$8 -7.62,-2.54; P$9 -7.62,-3.81; P$10 -7.62,-5.08; P$11 -7.62,-6.35; P$12 7.62,-6.35; P$13 7.62,-5.08; P$14 7.62,-3.81; P$15 7.62,-2.54; P$16 7.62,-1.27; P$17 7.62,0; P$18 7.62,1.27; P$19 7.62,2.54; P$20 7.62,3.81; P$21 7.62,5.08; P$22 7.62,6.35
TP10R = smd 1 x 1: TP 0,0
SC70-5L = smd 0.35 x 0.8: 1 -0.65,-0.85; 2 0,-0.85; 3 0.65,-0.85; 4 0.65,0.85; 5 -0.65,0.85
SC70-5_DCK = smd 0.4 x 0.9: 1 -0.65,-1.1; 2 0,-1.1; 3 0.65,-1.1; 4 0.65,1.1; 5 -0.65,1.1
TQFP44 = smd 1.5 x 0.5: 1 -5.8,4; 2 -5.8,3.2; 3 -5.8,2.4; 4 -5.8,1.6; 5 -5.8,0.8; 6 -5.8,0; 7 -5.8,-0.8; 8 -5.8,-1.6; 9 -5.8,-2.4; 10 -5.8,-3.2; 11 -5.8,-4; 23 5.8,-4; 24 5.8,-3.2; 25 5.8,-2.4; 26 5.8,-1.6; 27 5.8,-0.8; 28 5.8,0; 29 5.8,0.8; 30 5.8,1.6; 31 5.8,2.4; 32 5.8,3.2; 33 5.8,4 | smd 0.5 x 1.5: 12 -4,-5.8; 13 -3.2,-5.8; 14 -2.4,-5.8; 15 -1.6,-5.8; 16 -0.8,-5.8; 17 0,-5.8; 18 0.8,-5.8; 19 1.6,-5.8; 20 2.4,-5.8; 21 3.2,-5.8; 22 4,-5.8; 34 4,5.8; 35 3.2,5.8; 36 2.4,5.8; 37 1.6,5.8; 38 0.8,5.8; 39 0,5.8; 40 -0.8,5.8; 41 -1.6,5.8; 42 -2.4,5.8; 43 -3.2,5.8; 44 -4,5.8
LQFP-32 = smd 0.5 x 1.45: 1 -2.7,-4; 2 -1.9,-4; 3 -1.1,-4; 4 -0.3,-4; 5 0.5,-4; 6 1.3,-4; 7 2.1,-4; 8 2.9,-4; 17 2.9,4.2; 18 2.1,4.2; 19 1.3,4.2; 20 0.5,4.2; 21 -0.3,4.2; 22 -1.1,4.2; 23 -1.9,4.2; 24 -2.7,4.2 | smd 1.45 x 0.5: 9 4.2,-2.7; 10 4.2,-1.9; 11 4.2,-1.1; 12 4.2,-0.3; 13 4.2,0.5; 14 4.2,1.3; 15 4.2,2.1; 16 4.2,2.9; 25 -4,2.9; 26 -4,2.1; 27 -4,1.3; 28 -4,0.5; 29 -4,-0.3; 30 -4,-1.1; 31 -4,-1.9; 32 -4,-2.7
LGA-14-LARGEPAD = smd 1.5 x 0.6: 1 -1.3,2; 2 -1.3,1.2; 3 -1.3,0.4; 4 -1.3,-0.4; 5 -1.3,-1.2; 6 -1.3,-2; 8 1.3,-2; 9 1.3,-1.2; 10 1.3,-0.4; 11 1.3,0.4; 12 1.3,1.2; 13 1.3,2 | smd 0.6 x 1.5: 7 0,-2.3; 14 0,2.3
EIAJ-SOIC8 = smd 2.2 x 0.5: 1 -2.9,1.905; 2 -2.9,0.645; 3 -2.9,-0.625; 4 -2.9,-1.895; 5 2.9,-1.905; 6 2.9,-0.635; 7 2.9,0.635; 8 2.9,1.905
P-LCC-4_SMALLPAD = smd 1.1 x 1.5: 1 -0.75,-1.5; 2 -0.75,1.5; 3 0.75,1.5; 4 0.75,-1.5
SOT323 = smd 0.7 x 0.9: 1 -0.65,-1; 2 0.65,-1; 3 0,1
SOT223 = smd 1.219 x 2.235: 1 -2.311,-3.099; 2 0,-3.099; 3 2.311,-3.099 | smd 3.6 x 2.2: 4 0,3.099
SOT-23 = smd 0.787 x 0.889: 1 0.025,-1.016; 2 -0.94,1.016; 3 0.991,1.016
R0603 = smd 1 x 1.1: 1 -0.85,0; 2 0.85,0
R1206 = smd 1.6 x 1.803: 1 -1.422,0; 2 1.422,0
PANASONIC_EVQP2_TACT-SWITCH = smd 1.45 x 1: 1 2.575,0.85; 2 2.575,-0.85; 3 -2.575,0.85; 4 -2.575,-0.85
UX60-MB-5ST = smd 2 x 0.5: 1 2.25,1.6; 2 2.25,0.8; 3 2.25,0; 4 2.25,-0.8; 5 2.25,-1.6 | smd 2.2 x 2.5: M1 -3.3,-4.2; M2 -3.3,4.2; M3 2,4.2; M4 2,-4.2 | hole 0.9: 0,-1.75; 0,1.75
53047-04 = drill 0.5 pad 0.698 long: 1 1.875,0.45; 2 0.625,0.45; 3 -0.625,0.45; 4 -1.875,0.45
ABS10_SMD_CRYSTAL = smd 1.3 x 2.2: P$1 -2.1,0; P$2 2.1,0
XTAL-5.2X7.2 = smd 2.21 x 1.397: 1 -3.048,-1.27; 2 -3.048,1.27; 3 3.251,1.27 | smd 2.388 x 1.397: 4 3.162,-1.27

### Placement (x,y rotation side)
ANT1  26,27 90 bottom
BATT+  7,50 0 top
BATT-  12.5,50 0 top
C1  43,11.9 0 top
C2  49,10 180 top
C3  43,23.2 0 top
C4  14.1,43.4 180 top
C20  31.6,45 0 top
C21  24,35.6 180 top
C22  36.6,28.4 0 top
C23  42.5,38 0 top
C24  45.5,34.4 0 top
C25  45.5,36.3 0 top
C26  42.5,39.9 0 top
C27  42.5,43 180 top
C30  26,13.5 180 top
C31  41.4,14.2 0 top
C32  28.7,5 180 top
C33  41.1,7.3 0 top
C34  37.1,47.7 0 top
C35  26.9,47.8 180 top
C36  9.1,4 180 top
C37  13.6,3.6 0 top
C38  21,49.8 180 top
C39  26,11.6 180 top
D1  48,19 180 top
GND  52.5,30 270 bottom
GPS1  15.15,15.3 90 top
GPX  31.3,21.5 270 top
IC1  14.5,40.5 270 top
IC2  45,9.5 270 top
IC20  33,37 270 top
IC21  42.3,45.8 270 top
IC30  34,15 90 top
IC31  32,49 90 top
IC33  21,46 0 top
LED1  45,49 0 bottom
LED2  45,5 0 bottom
Q1  48,16 90 top
Q2  11,32 90 top
Q3  15,37.2 0 top
R1  43.5,19 180 top
R2  43.5,17.1 180 top
R3  39,25.3 0 top
R4  39,23.4 180 top
R5  11,38.7 0 top
R6  11,41.4 180 top
R7  11,45.3 0 top
R8  14.1,45.3 180 top
R9  11,43.4 0 top
R10  13,47.5 180 top
R11  22.1,39.7 180 top
R12  19,39.7 180 top
R20  48,3.9 180 top
R21  48,7 180 top
R22  48,47 180 top
R23  48,50 180 top
R30  43.4,27.8 0 top
R31  43.4,25.9 0 top
RX  52,35.5 270 bottom
SW1  52,46.5 90 bottom
SW2  52,7.5 90 bottom
TX  52,33.5 270 bottom
X1  49,27 180 top
X5  52.5,40 270 bottom
XT20  42.6,34 90 top
XT30  35,6 180 top

### Tracks (layer width: path | path; a pad name or v marks a point on that pad's centre or on a via)
+3V  (via drill 0.38, 0.51)  (27 unrouted)
  Top 0.254: IC33.3 19.62,45.38 v20,45 | IC30.10 35.9,20.5 v36.4,21
  Top 0.4: IC20.31 v35.4,29.8 35.4,28.45 C22.1 | v24.7,37 24.7,35.55 C21.1 24.9,35.5 25,35.4 IC20.19 | IC20.39 v40.6,37 40.65,37 C23.1 | C20.1 30.6,44.75 | IC31.1 v28.8,47.7 27.9,47.7 C35.1 | C34.1 v35.2,47.7 IC31.6 | C38.1 v23,49.8 23.6,49.2 23.6,47.9 IC33.8 IC33.7 | IC20.9 30.6,44.85 C20.1 | v29.7,45.3 30,45 C20.1
  Route15 0.4: 27.5,9 25,6.5 13.5,6.5 v11.5,4.5
  Route15 0.8: X5.4 51.73,41.9 49.5,41.9
  other vias: 47,11 39.5,14.2 28.3,13.5 44.4,44.7
  pour Route15 (isolate 0.5): 17,46 50,46 50,51 17,51
  pour Route15 (isolate 0.508): 17,47 17,42 26.5,33 26.5,8 50,8 50,47
  pour Top (no thermals): 45.7,10 45.7,11 45.8,11.1 46.2,11.5 48.2,11.5 48.6,11.1 48.6,9.5 47.5,9.5 47,10
  pour Top (isolate 0.305, no thermals): 40.5,13.5 37.3,13.5 37.3,14.9 40.5,14.9
  pour Top (no thermals): 30.4,14 26.4,14 26.4,13 30.4,13
  pour Top (isolate 0.381, no thermals): 11,9 11.7,9 11.7,5.8 13.3,5.8 13.3,3.2 9.5,3.2 9.5,5.8 11,5.8
  pour Top (isolate 0.3, no thermals): 42.8,45.2 42.8,42.5 44.5,42.5 45,43 45,45.2
AX-CS  (via drill 0.38)
  Top 0.254: IC31.7 35.9,49 v36.4,49.5 | v35.4,44.7 34.6,43.9 IC20.4
  Route2 0.4: v36.4,49.5 37.1,48.8 37.1,46.4 v35.4,44.7
AX-INT1  (via drill 0.38)
  Top 0.254: IC31.8 37.1,50.3 v37.9,49.5 | v37.3,44.5 36.6,44.5 36.2,44.1 IC20.2
  Route2 0.4: v37.3,44.5 37.4,44.5 37.9,45 v37.9,49.5
AX-INT2  (via drill 0.38)
  Top 0.254: IC31.9 33.2,51.2 33.5,51.5 34.9,51.5 v35.1,51.3 | IC20.5 v33.8,44.5
  Route2 0.4: v35.1,51.3 35.1,49.3 36.2,48.2 36.2,47.1 35.3,46.2 34.9,46.2 33.8,45.1 v33.8,44.5
D+
  Top 0.254: X1.3 45.5,27 45,27.5 45,27.6 44.8,27.8 R30.2
D-
  Top 0.254: X1.2 45.3,26.2 45,25.9 R31.2
DEBUG-RX  (via drill 0.38)
  Top 0.254: IC20.32 36.2,30.2 36.7,29.7 39,29.7 v39.3,30
  Route2 0.4: v39.3,30 40.3,31.2 41.2,31.2 45.5,35.5 RX.TP
  other vias: 52,35.5
DEBUG-TX  (via drill 0.38)
  Top 0.254: IC20.33 37,30.9 40.1,30.9 40.7,30.3 v40.7,30
  Route2 0.4: v40.7,30 42,30 45.5,33.5 TX.TP
  other vias: 52,33.5
FL-CS
  Top 0.254: IC20.10 29.8,43.7 27.5,46 21.5,46 19.6,47.9 IC33.1
GND  (via drill 0.38, 0.51, 0.76)  (86 unrouted)
  Top 0.254: 50.5,38 50.62,38.12 X5.1 | v52.8,11.5 50.5,11.5 | IC1.2 14.3,40.5 14.5,40.7 14.5,42 | 14.5,39.2 14.5,40.5
  Top 0.4: 42.5,9.5 IC2.2 | 40,45.8 IC21.2 42.3,45.8
  Bottom 0.254: SW2.3 SW2.1 52.85,11.45 v52.8,11.5 | 53.3,38.1 53.3,42.6 52.9,43 52.9,43.88 SW1.3 | GND.TP 52.5,31.7 53.3,32.5 53.3,38.1 | 53.3,38.1 52.08,38.1 X5.1
  Bottom 0.4: SW1.1 SW1.3 52.85,46.05
  other vias: 17.6,15.3 17.6,17.8 17.6,12.7 15.1,12.7 15.15,15.3 15.1,17.7 12.6,17.7 12.6,15.2 12.6,12.7 21.5,29.1 23,28.5 20,28.5 19.4,27 23.6,27 20,25.5 23,25.5 19,29.5 24,29.5 23,23.7 23,22 24,21 20.28,20.54 22.58,20.52
  pour Bottom (isolate 0.2, rank 3, no thermals): 1.25,51.75 50.75,51.75 50.75,2.25 1.25,2.25 1.25,23 24,23 24,31 1.25,31
  pour Bottom (no thermals): 25,32 1.25,32 1.25,22 25,22
  pour Bottom (isolate 0.3, rank 3, no thermals): 1.25,51.75 50.75,51.75 50.75,2.25 1.25,2.25 1.25,23 24,23 24,31 1.25,31
  pour Top (isolate 0.381, rank 3, no thermals): 2,51.75 50.75,51.75 50.75,2.25 2,2.25
GPS-ON_OFF  (via drill 0.38)
  Top 0.254: v25.9,33.8 IC20.21
  Top 0.4: v8.5,27.3 8.7,27.3 9.3,27.9 12.1,27.9 12.6,27.4 GPS1.P$19
  Route2 0.4: v25.9,33.8 24.7,35 17.7,35 16.2,33.5 13,33.5 8.5,29 v8.5,27.3
GPS-RESET  (via drill 0.38)
  Top 0.254: v29,35 28.6,34.6 IC20.20
  Top 0.381: GPS1.P$1 8.8,7.7 7.1,7.7 v6.8,8
  Route2 0.4: v6.8,8 7,8.2 7,29 14,36 25.5,36 26.5,35 v29,35
GPS-RFPWUP  (via drill 0.38)
  Top 0.254: v29,37 IC20.17
  Top 0.381: GPS1.P$4 12.61,5.69 13.5,4.8 15.4,4.8 v15.5,4.7
  Route2 0.381: 15.5,5.5 v15.5,4.7
  Route2 0.4: 15.5,5.5 14.5,6.5 6.5,6.5 5.7,7.3 5.7,9.2 6,9.5 6,29.5 13.5,37 23.2,37 24.2,38 25.5,38 26.5,37 v29,37
GPS-RX  (via drill 0.38)
  Top 0.4: IC20.23 29,31 v28.3,31 | v11.5,26.9 9.5,26.9 8.8,26.2 GPS1.P$22
  Route2 0.4: v28.3,31 27.6,31.7 24.3,31.7 23,33 18.3,33 16.8,31.5 14,31.5 11.5,29 v11.5,26.9
GPS-TX  (via drill 0.38)
  Top 0.254: v29,33.5 28.6,33.5 28.2,33.1 27.3,33.1 IC20.22
  Top 0.4: v10.1,26 10.1,22.95 GPS1.P$21
  Route2 0.4: v29,33.5 28.2,32.7 25,32.7 23.7,34 18,34 16.5,32.5 13.5,32.5 10.1,29.1 v10.1,26
INT1  (via drill 0.38)
  Top 0.254: IC30.17 29.8,21.8 30,22 31,23 v31,26 | v33.3,26.5 33.3,26.8 33,27.1 IC20.28
  Route2 0.4: v31,26 32,26 32.5,26.5 v33.3,26.5
MISO1  (via drill 0.38)
  Top 0.254: IC30.13 33.5,24.5 33.3,24.7 v33.3,25 | v31,28 31.4,28.4 IC20.26
  Route2 0.254: v33.3,25 33.5,25
  Route2 0.4: 33.5,25 34.3,25.8 34.3,27.1 33.4,28 v31,28
MISO2  (via drill 0.38)
  Top 0.254: IC33.2 18.14,46.6 19.8,46.6 21.7,44.7 26.2,44.7 v27.2,43.7 IC20.12 | IC31.12 30.8,51.2 30.5,51.5 28.5,51.5 v28,51
  Route2 0.4: v28,51 28,50.5 26.7,49.2 26.7,44.2 v27.2,43.7
MOSI1
  Top 0.254: IC30.14 32.7,23.8 32.2,24.3 IC20.27
MOSI2  (via drill 0.38)
  Top 0.254: IC20.13 26.2,40.2 26,40.4 26,41.5 26.1,41.6 v26.1,43 26.1,43.5 25.6,44 24,44 IC33.5 | IC31.13 30,50.2 29.9,50.1 26.9,50.1 v26.5,50.5
  Route2 0.4: v26.5,50.5 25.9,49.9 25.9,43.2 v26.1,43
N$1
  Top 0.4: Q2.1 15.19,29.69 17.5,32 17.5,35.5 17,36 15.21,36 Q3.1
N$2
  Top 0.4: R6.2 10.15,40.35 10.5,40 11,40 11.8,39.2 11.8,38.75 R5.2 11.9,38.7 11.9,38.6 12,38.5 13.6,38.5 14,38.1 14.06,38.06 Q3.2
N$3
  Top 0.254: IC30.15 31.9,20.9 GPX.TP
N$4
  Top 0.254: IC20.1 37,43.3 39.8,43.3 40.5,44 40.5,44.5 41.15,45.15 IC21.3
N$6
  Top 0.8: GPS1.P$12 ANT1.ANT
N$7
  Top 0.8: R1.1 D1.A
N$8
  Top 0.254: Q3.3 15.99,39.71 15.9,39.8 15.4,39.8 IC1.4
N$9
  Top 0.254: 11.95,41.5 R6.1 11.9,41.35 11.9,40.6 12.65,39.85 IC1.3
  Top 0.4: R6.1 R9.2
N$10
  Top 0.254: Q1.1 48.25,15.35 48,15.6 48,16.6 47.5,17.1 R2.1
N$12
  Top 0.254: IC2.3 44.65,8.85 44.9,9.1 44.9,9.9 44.6,10.2 43.95,10.2 IC2.1
  Top 0.4: 49.7,16.7 49.5,16.7 | 49.05,16.7 Q1.2
  Top 0.5: 49.5,16.7 49.05,16.7
  Top 0.8: D1.C 49.7,16.7 50.4,16 50.4,13.6 49.3,12.5 45.7,12.5 45.1,11.9 C1.2
  pour Top (no thermals): 43.6,12.5 44.3,12.5 44.3,10.2 43.6,10.2
N$14
  Top 0.254: IC20.36 41.4,34.6 41.6,34.4 42.6,34.4 | 42.6,34.4 XT20.P$1 42.75,31.8 | 42.6,34.4 C24.1
N$15
  Top 0.254: IC20.37 40.8,35.4 41,35.6 42.3,35.6 XT20.P$2 42.8,36.3 C25.1
N$16
  Top 0.254: IC30.27 32.7,9.8 33,9.5 37,9.5 38,8.5 38,7.32 | XT30.1 40.22,7.27 C33.1
  Top 0.4: 38,7.32 XT30.1
N$17
  Top 0.254: IC30.26 31.9,9.9 31,9 30.3,9 29.8,8.5 29.8,5.15 31.33,5.15
  Top 0.4: C32.1 29.8,5.15 | 31.33,5.15 XT30.3
N$18
  Top 0.254: R10.2 9.5,47.5 8.1,46.1 8.1,44.4 9.1,43.4 R9.1
  Top 0.4: R9.1 10.1,43.55
  Top 1: BATT-.TP 12.5,49.4 11.9,48.8 11.9,47.52 R10.2
N$19  (via drill 0.38)
  Top 0.254: IC30.21 28.1,14.7 27.4,15.4 27.4,22.9 v29.5,25 | v41.3,27 41.3,27.5 41.6,27.8 R30.1
  Route2 0.4: v29.5,25 31,25 32.5,23.5 37.4,23.5 40.9,27 v41.3,27
N$20  (via drill 0.38)
  Top 0.254: R31.1 41.5,25.9 v41.3,25.7 | IC30.20 28.7,15.5 28.2,16 28.2,22.2 v29.5,23.5
  Route2 0.4: v29.5,23.5 31,23.5 32,22.5 38.1,22.5 v41.3,25.7
N$21  (via drill 0.38)
  Top 0.254: IC20.15 v30.5,38.6 | v49,48.5 49,49.85 R23.1
  Route2 0.4: v30.5,38.6 30.8,38.3 35.2,38.3 39.4,42.5 45.5,42.5 49,46 v49,48.5
N$22  (via drill 0.38)
  Top 0.254: v44.3,3.5 45.2,3.5 45.6,3.9 R20.2
  Bottom 0.254: LED2.4 v44.3,3.5
N$23  (via drill 0.38)
  Top 0.254: v45.8,6.5 45.8,6.8 46,7 R21.2
  Bottom 0.254: LED2.2 v45.8,6.5
N$24  (via drill 0.38)
  Top 0.254: IC20.14 28.7,39.4 v29,39.7 | v47.5,48.5 47.8,48.5 48.85,47.45 R22.1
  Route2 0.4: v29,39.7 31,39.7 31.5,39.2 34.8,39.2 39.1,43.5 45,43.5 47.5,46 v47.5,48.5
N$25  (via drill 0.38)
  Top 0.254: R21.1 49.5,7 v50,6.5 | v37.3,37.6 37.5,37.8 IC20.40
  Route2 0.4: v50,6.5 51.8,6.5 52.3,7 52.3,8.7 50,11 50,12.5 48.5,14 48.5,19 42.5,25 42.5,27.8 42.2,28.1 38.4,28.1 37.4,29.1 37.4,37.5 v37.3,37.6
N$26  (via drill 0.38)
  Top 0.254: R22.2 46.7,47.4 45.6,47.4 45.5,47.5 45.4,47.6 v44.3,47.6
  Bottom 0.254: LED1.4 v44.3,47.6
N$27  (via drill 0.38)
  Top 0.254: v45.8,50.5 46.3,50 R23.2
  Bottom 0.254: LED1.2 v45.8,50.5
N$28  (via drill 0.38)
  Top 0.254: IC20.35 40.4,33.8 v40.5,33.7 | v48.9,39.4 51.83,39.4 X5.2
  Route2 0.254: v40.5,33.7 40.5,34
  Route2 0.4: 40.5,34 45.9,39.4 v48.9,39.4
N$29  (via drill 0.38)
  Top 0.254: IC20.34 39.7,33 40.2,32.5 v40.7,32.5
  Route2 0.4: v40.7,32.5 40.9,32.5 46.4,38 49.3,38 50.2,38.9 50.2,39.8 51.02,40.6
  Route2 0.8: 51.02,40.6 X5.3
N$30  (via drill 0.38)
  Top 0.254: IC20.44 39.9,41 v40.3,41.4
  Route2 0.4: v40.3,41.4 45.9,41.4 51,46.5 v51.2,46.5
  Bottom 0.4: SW1.4 51.2,46.48 v51.2,46.5 51.15,46.55 SW1.2
N$31  (via drill 0.38)
  Top 0.254: R20.1 49.6,3.9 v50,4.3 | v40.3,38.6 IC20.41
  Route2 0.4: v50,4.3 51.2,5.5 52.1,5.5 53.1,6.5 53.1,9.4 51,11.5 51,13 49.5,14.5 49.5,19.5 43.5,25.5 43.5,28.5 43,29 38.8,29 38.3,29.5 38.3,36.6 v40.3,38.6
N$32  (via drill 0.38)
  Top 0.254: v29,28 29.5,28.5 29.5,29.9 29.8,30.2 IC20.24
  Route2 0.4: v51.2,7.7 49,9.9 49,12 47.5,13.5 47.5,16.5 43.5,20.5 39,20.5 38,19.5 30.4,19.5 28.5,21.3 28.5,27.5 v29,28
  Bottom 0.254: SW2.4 SW2.2 51.15,7.65 v51.2,7.7
N$33
  Top 0.254: R7.2 R8.2 C4.2 13.25,42.15 13.6,41.8 13.6,41.2 IC1.1
SCK1  (via drill 0.38)
  Top 0.254: IC30.11 35.1,24.5 35.3,24.7 v35.3,25 | v30.5,29.5 30.6,29.6 IC20.25
  Route2 0.4: v35.3,25 35.3,27.7 33.5,29.5 v30.5,29.5
SCK2  (via drill 0.38)
  Top 0.254: IC33.6 23.93,45.4 27,45.4 29,43.4 IC20.11 28.8,43 v28.2,43 | IC31.14 28.6,49 v28.4,49.2
  Route2 0.4: v28.4,49.2 27.7,48.5 27.7,46.5 28.2,46 v28.2,43
SS1
  Top 0.254: IC30.12 34.3,27.1 33.8,27.6 IC20.29
V_BAT  (via drill 0.38)
  Top 0.254: IC20.43 v40.3,40.2 40.4,40.2 40.7,39.9 C26.1
  Top 0.381: R12.1 R11.2 21.45,39.55 21.2,39.3 v21.2,38.3
  Route2 0.4: v21.2,38.3 22.2,39.3 25.7,39.3 26.8,38.2 29.3,38.2 30.2,37.3 35.5,37.3 37.6,39.4 39.5,39.4 v40.3,40.2
V_COMP  (via drill 0.38)
  Top 0.254: R4.2 R3.1 38.15,25.15 38.2,25.2 v38.2,26.7 | IC20.42 37.2,39.4 36.2,38.4 v36.2,36.3
  Route2 0.4: v38.2,26.7 36.5,28.4 36.5,36 v36.2,36.3
VAMP  (via drill 0.38)
  Top 0.254: v35.4,41.3 IC20.3 | IC1.5 16.15,41.15 v16.8,40.5
  Route2 0.4: v16.8,40.5 28.3,40.5 28.6,40.8 31.9,40.8 32.5,40.2 34.4,40.2 v35.4,41.3
VBAT  (via drill 0.38, 0.51)
  Top 0.381: v22.9,38.3 22.9,39.45 R11.1
  Top 0.4: v7,36.5 7,36
  Top 0.813: v46,16 Q1.3
  Route2 1: v46,16 33,3 v3.5,3
  Route15 0.4: v22.9,38.3 22.9,37.1 22.3,36.5 v7,36.5
  pour Top (isolate 0.4, no thermals): 1.25,51.75 10,51.75 10,49 8,47 8,37 12,33 15.2,33 15.2,31 12,31 5,24 5,2.25 1.25,2.25
VBUS  (via drill 0.38, 0.51)
  Top 0.254: R4.1 39.85,22.05 v39.9,22
  Top 0.4: v29.5,11 29.5,12 IC30.24
  Top 0.5: X1.1 45.8,25.4 44.1,23.7 44.1,23.45 C3.2 44,23.05
  Top 0.508: C39.1 28.2,11.6 28.9,12.3 IC30.24
  Top 0.8: C3.2 43.95,21.65 42.6,20.3 42.6,19.05 R1.2 | R1.2 R2.2 | v41.5,19 R1.2
  Top 1: Q2.3 15.31,34.31 v15.8,34.8
  Route15 0.4: 30,19 30,11.5 v29.5,11 | v39.9,22 39.9,20.6 v41.5,19
  Route15 1: v15.8,34.8 23.2,34.8 27,31 27,22 30,19 v41.5,19
VREF  (via drill 0.38)
  Top 0.254: v33,41.3 IC20.6 | R7.1 v9.1,45.3
  Route2 0.4: v9.1,45.3 12.7,41.7 32.6,41.7 v33,41.3
(copper drawn outside any net)
  shapes: Top area x2